# EasyEDA Pro project ProProject_FOCBalanceCar_2024-04-13.epro

# Schematic Schematic1
Create Date: 2024-03-26; Page Name: P1; Project Name: FOCBalanceCar; Schematic Name: Schematic1; Update Date: 2024-03-28; Company: 嘉立创EDA; Page Size: A3; Version: V1.0
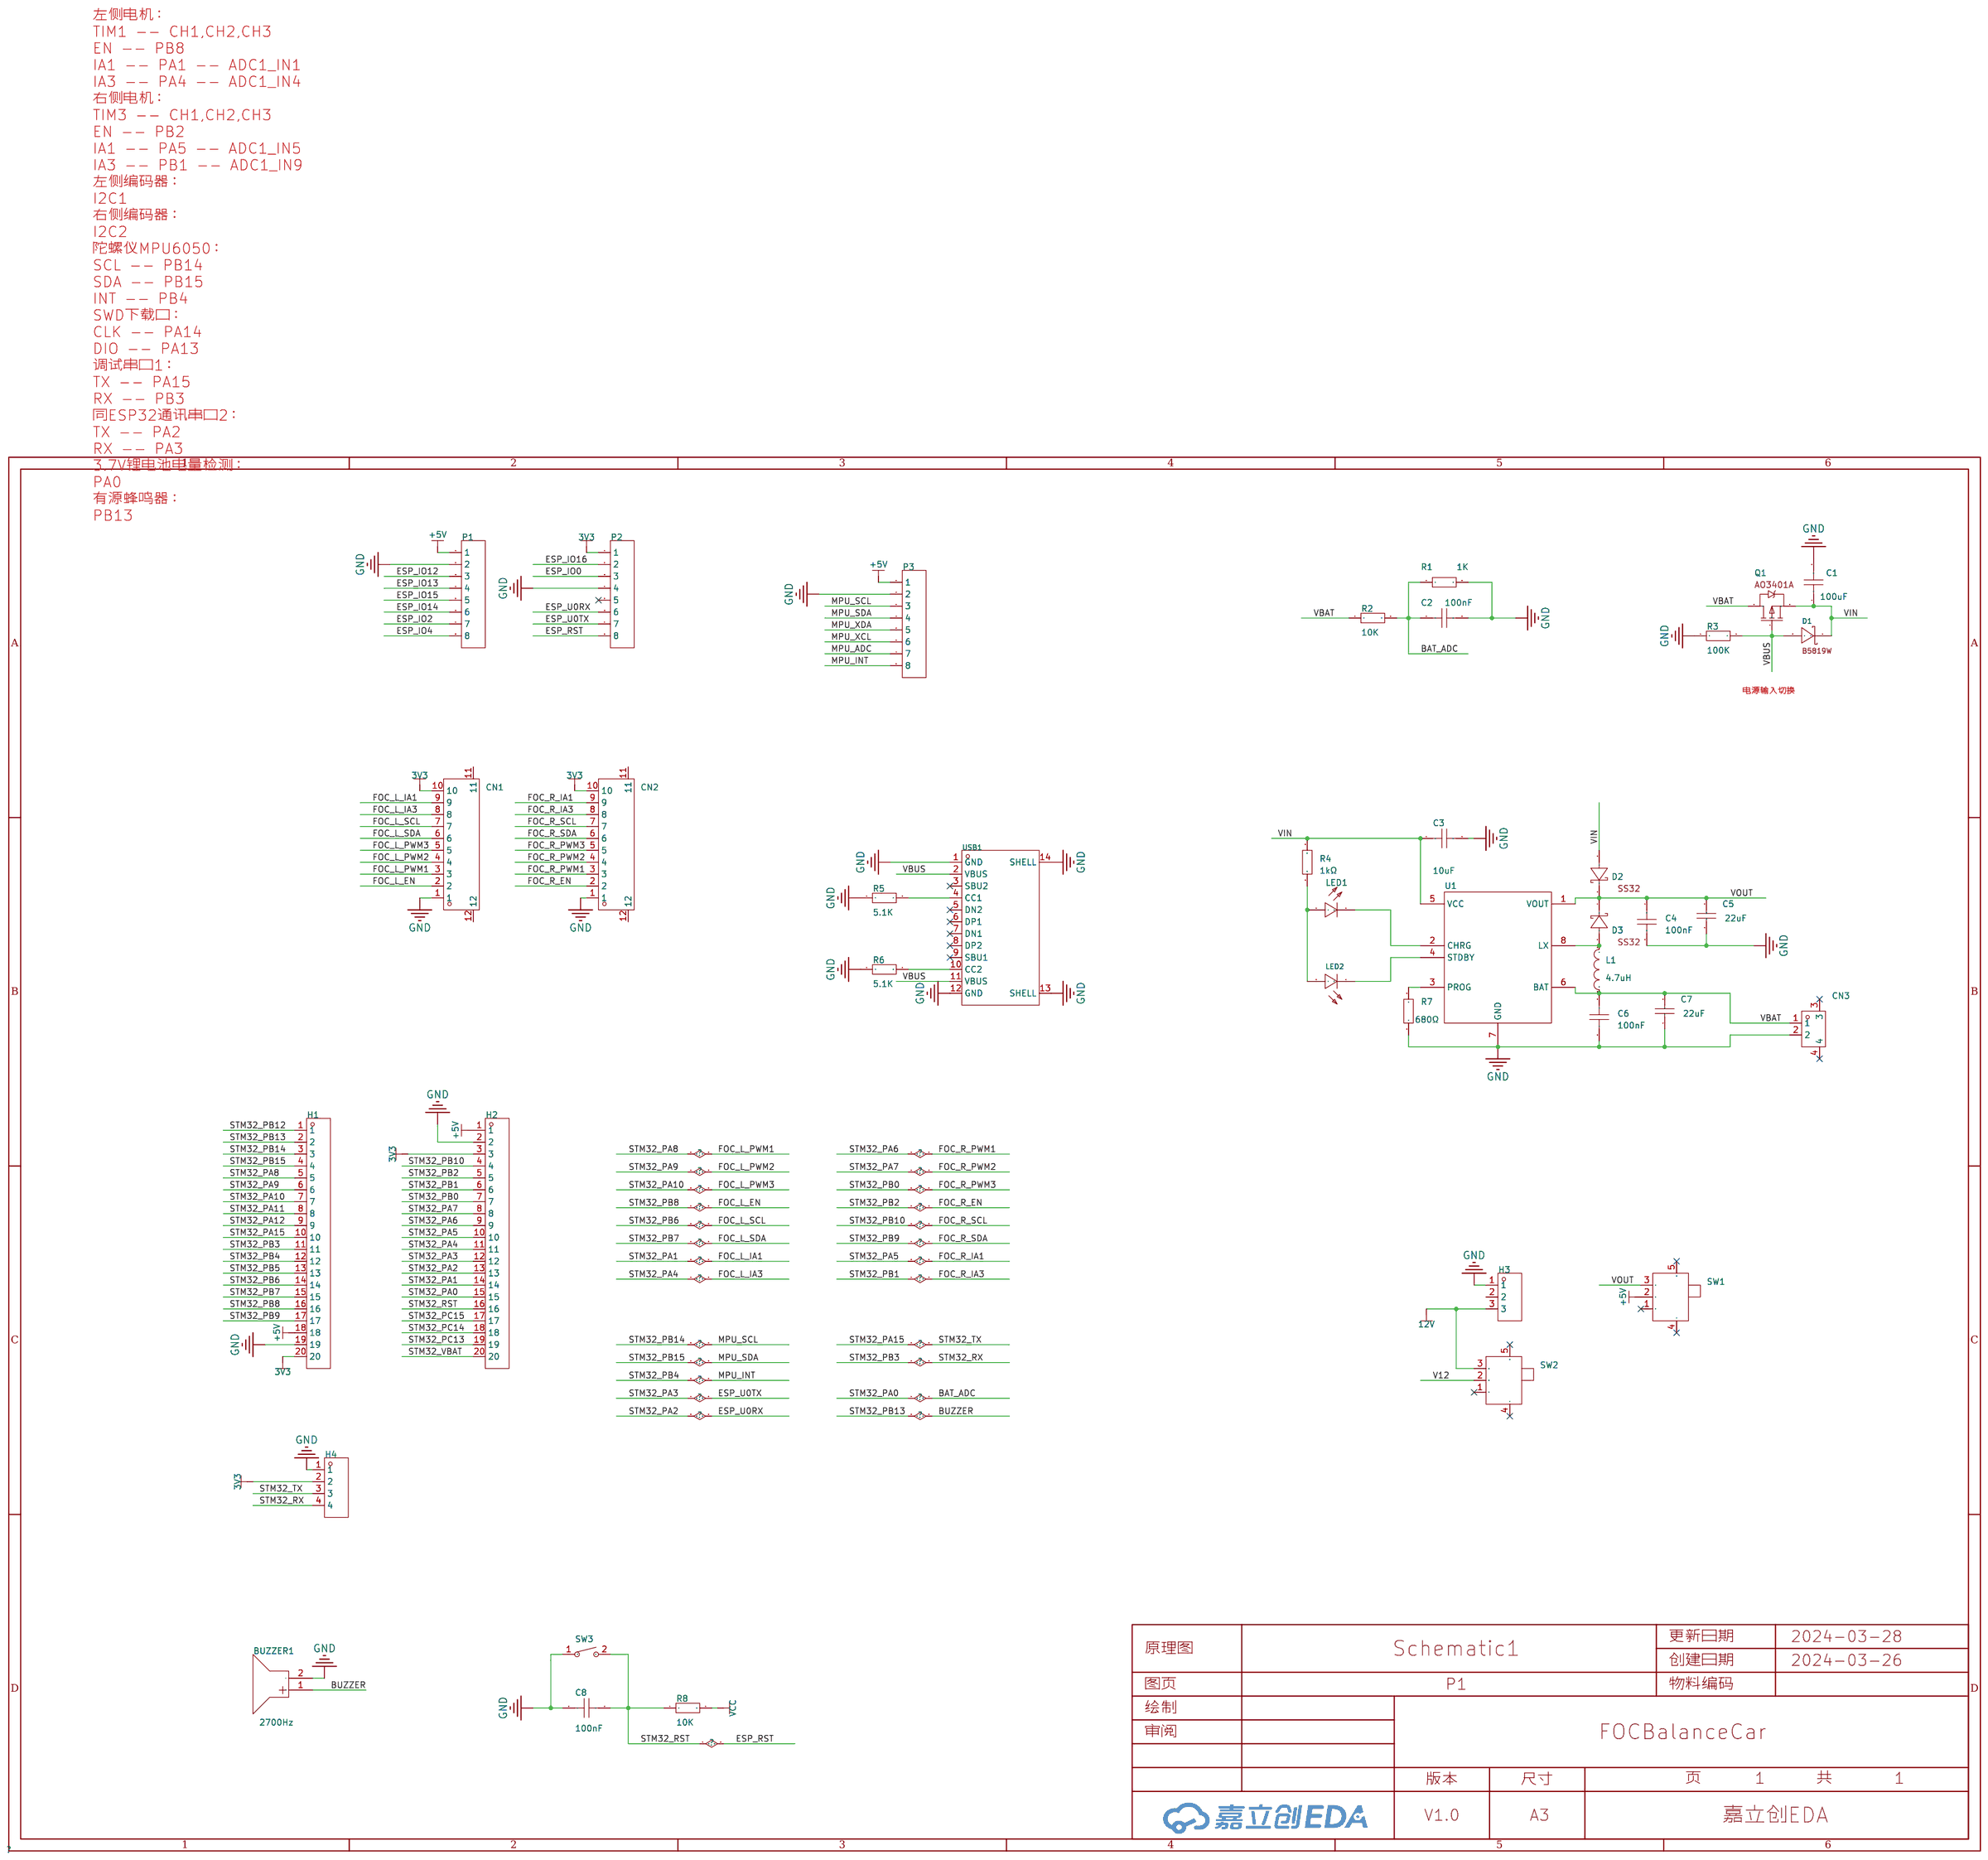
[diagram p0: schematic sheet]

## Parts
BUZZER1  2700Hz  [BUZ-TH_BD9.0-P5.00-D0.6-FD]
C1  100uF  [C0603]
C2  100nF  [C0603_1]
C3  10uF  [C0603]
C4  100nF  [C0603]
C5  22uF  [C1206]
C6  100nF  [C0603]
C7  22uF  [C1206]
C8  100nF  [C0603]
CN1  1.0-10P WT  [CONN-SMD_10P-P1.00_1.0-10P-WT]
CN2  1.0-10P WT  [CONN-SMD_10P-P1.00_1.0-10P-WT]
CN3  1.5-2P WT  [CONN-SMD_1.5-2P-WT]
D1  B5819W  [SOD-123_L2.8-W1.8-LS3.7-RD]
D2  -  [SMA_L4.2-W2.7-LS5.0-RD]
D3  -  [SMA_L4.2-W2.7-LS5.0-RD]
H1  22850120ANG1SYA01  [HDR-TH_20P-P2.54-V-F]
H2  22850120ANG1SYA01  [HDR-TH_20P-P2.54-V-F]
H3  PZ254R-11-03P  [HDR-TH_3P-P2.54-H-M-W10.4]
H4  PZ254V-11-04P  [HDR-TH_4P-P2.54-V-M]
L1  4.7uH  [IND-SMD_L4.0-W4.0]
LED1  19-217/R6C-AL1M2VY/3T  [LED0603-RD]
LED2  19-217/GHC-YR1S2/3T  [LED0603-RD]
P1  2.54-1*8P母环保  [HDR-TH_8P-P2.54-V-F-1]
P2  2.54-1*8P母环保  [HDR-TH_8P-P2.54-V-F-1]
P3  2.54-1*8P母环保  [HDR-TH_8P-P2.54-V-F-1]
Q1  AO3401A  [SOT-23-3_L2.9-W1.3-P1.90-LS2.4-BR]
R1  1K  [R0603_1]
R2  10K  [R0603]
R3  100K  [R0603]
R4  1kΩ  [R0603]
R5  5.1K  [R0603]
R6  5.1K  [R0603]
R7  680Ω  [R0805]
R8  10K  [R0603]
SW1  SS12D07VG5 087  [SW-TH_SS12D07VG4]
SW2  SS12D07VG5 087  [SW-TH_SS12D07VG4]
SW3  TS342A2P-WZ  [SW-SMD_L4.0-W2.9-LS5.0]
U1  -  [TP5410_SOP8]
USB1  TYPE-C 16PIN 2MD(073)  [USB-C-SMD_TYPE-C-6PIN-2MD-073]

## Library data of the parts
BUZZER1 = FMB09A03-3V: 驱动方式:有源(内含驱动线路);构造类型:电磁式;额定电压:3V;工作电压:2V~4.2V;频率:2700Hz;声压(SPL):80dB@3V,10cm;直径(φD):9mm;高度:5.7mm;; LCSC Part Name: 电磁式3V 2700HZ; Supplier Part: C417385; Manufacturer: FUET(福声科技); Supplier Footprint: 插件; JLCPCB Part Class: 扩展库; Datasheet: https://atta.szlcsc.com/upload/public/pdf/source/20200513/C417385_7DAABD1634B445C5EA862EA31FBF59FC.pdf; Supplier: LCSC; Oscillator Circuit: 有源(内含驱动线路); Technology Type: 电磁式; Rated Voltage: 3V; Operating Voltage: 2V~4.2V; Sound Pressure Level (SPL): 80dB@3V,10cm; Diameter (φD): 9mm; Height: 5.7mm
C1 C3 C8 = CAP_0603: Supplier Footprint: 0603
C2 = CC0603KRX7R9BB104_1: 容值:100nF;精度:±10%;额定电压:50V;温度系数:X7R;; LCSC Part Name: 100nF ±10% 50V; Supplier Part: C14663; Manufacturer: YAGEO(国巨); Manufacturer Part: CC0603KRX7R9BB104; Supplier Footprint: 0603; JLCPCB Part Class: Basic Part; Datasheet: https://atta.szlcsc.com/upload/public/pdf/source/20170116/1484561234239.pdf; Supplier: LCSC; Tolerance: ±10%; Voltage Rated: 50V; Temperature Coefficient: X7R
C4 C6 = CL10B104KB8NNNC: 容值:100nF;精度:±10%;额定电压:50V;温度系数:X7R;; LCSC Part Name: 100nF ±10% 50V; Supplier Part: C1591; Manufacturer: SAMSUNG(三星); Supplier Footprint: 0603; JLCPCB Part Class: Extended Part; Datasheet: https://atta.szlcsc.com/upload/public/pdf/source/20160103/1457707680512.pdf; Supplier: LCSC; Tolerance: ±10%; Voltage Rated: 50V; Temperature Coefficient: X7R
C5 C7 = CL31A226KAHNNNE: 容值:22uF;精度:±10%;额定电压:25V;温度系数:X5R;; LCSC Part Name: 22uF ±10% 25V; Supplier Part: C12891; Manufacturer: SAMSUNG(三星); Supplier Footprint: 1206; JLCPCB Part Class: Basic Part; Datasheet: https://atta.szlcsc.com/upload/public/pdf/source/20160103/1457707667836.pdf; Supplier: LCSC; Tolerance: ±10%; Voltage Rated: 25V; Temperature Coefficient: X5R
CN1 CN2 = 1.0-10P WT: 插针结构:1x10P;间距:1mm;安装方式:卧贴;参考系列:SH;总PIN数:10P;排数:1;每排PIN数:10;额定电流:1A;工作温度范围:-25℃~+85℃;; LCSC Part Name: 间距:1mm 1x10P 卧贴; Supplier Part: C5340780; Manufacturer: SHOU HAN(首韩); Supplier Footprint: SMD,P=1mm,卧贴; JLCPCB Part Class: 扩展库; Datasheet: https://atta.szlcsc.com/upload/public/pdf/source/20221228/5D518FEC817C7477F643AF327F50CF0F.pdf; Supplier: LCSC; Pins Structure: 1x10P; Pitch: 1mm; Mounting Style: 卧贴; Reference Series: SH; Number of Pins: 10P; Number of Rows: 1; Number of PINs Per Row: 10; Current Rating (Max): 1A; Operating Temperature Range: -25℃~+85℃
CN3 = 1.5-2P WT: 插针结构:1x2P;间距:1.5mm;公母:公;安装方式:卧贴;行距:-;排数:1;每排PIN数:2;参考系列:ZH;额定电流:1A;工作温度范围:-25℃~+85℃;; LCSC Part Name: 1x2P 间距:1.5mm 卧贴 系列:ZH; Supplier Part: C2681533; Manufacturer: SHOU HAN(首韩); Supplier Footprint: SMD,P=1.5mm; JLCPCB Part Class: 扩展库; Datasheet: https://atta.szlcsc.com/upload/public/pdf/source/20210107/C2681535_97741691CC21DAF8D9FC266F7E994B99.pdf; Supplier: LCSC; Pins Structure: 1x2P; Pitch: 1.5mm; Gender: 公; Mounting Style: 卧贴; Number of Rows: 1; Number of PINs Per Row: 2; Reference Series: ZH; Current Rating (Max): 1A; Operating Temperature Range: -25℃~+85℃
D1 = B5819W_C64885: 直流反向耐压(Vr):40V;平均整流电流(Io):1A;正向压降(Vf):600mV@1A;; LCSC Part Name: 电压:40V 电流:1A SL; Supplier Part: C64885; Manufacturer: MDD; Supplier Footprint: SOD-123; JLCPCB Part Class: Extended Part; Datasheet: https://atta.szlcsc.com/upload/public/pdf/source/20230823/08094EB15E96CCD3558B35DDD25E45C2.pdf; Supplier: LCSC; Reverse Voltage (Vr): 40V; Average Rectified Current (Io): 1A; Forward Voltage (Vf@If): 600mV@1A
D2 D3 = SS32: 二极管配置:-;直流反向耐压(Vr):20V;平均整流电流(Io):3A;正向压降(Vf):550mV@3A;反向电流(Ir):500A@20V;; LCSC Part Name: 20V 3A 550mV@3A; Supplier Part: C2891717; Manufacturer: KUU; Supplier Footprint: SMA(DO-214AC); JLCPCB Part Class: Extended Part; Datasheet: https://atta.szlcsc.com/upload/public/pdf/source/20210901/43FECDC7C0D2D5B6002302D3612B6747.pdf; Supplier: LCSC; Reverse Voltage (Vr): 20V; Average Rectified Current (Io): 3A; Forward Voltage (Vf@If): 550mV@3A; Reverse Leakage Current (Ir): 500A@20V
H1 H2 = 22850120ANG1SYA01: 插孔结构:1x20P;间距:2.54mm;行距:-;安装类型:直插;排数:单排;总孔位数:20P;塑高:-;触头材质:黄铜;触头镀层:-;; LCSC Part Name: 间距:2.54mm 1x20P 直插; Supplier Part: C429947; Manufacturer: JILN(锦凌); Supplier Footprint: 插件,P=2.54mm; JLCPCB Part Class: 扩展库; Datasheet: https://atta.szlcsc.com/upload/public/pdf/source/20190920/C429966_F6288D72CB1EF194DAF75E8AC5D57877.pdf; Supplier: LCSC; Holes Structure: 1x20P; Pitch: 2.54mm; Mounting Type: 直插; Number of Rows: 单排; Number of Holes: 20P; Contact Material: 黄铜
H3 = PZ254R-11-03P: 插针结构:1x3P;间距:2.54mm;行距:-;圆针/方针:方针;安装类型:弯插;排数:单排;总PIN位数:3P;额定电流:-;额定电压:-;配合针长度:6mm;塑高:2.5mm;触头材质:黄铜;触头镀层:-;工作温度范围:-40℃~+105℃;颜色:黑色;; LCSC Part Name: 间距:2.54mm 1x3P 弯插 方针; Supplier Part: C492411; Manufacturer: XFCN(兴飞); Supplier Footprint: 弯插,P=2.54mm; JLCPCB Part Class: 扩展库; Datasheet: https://atta.szlcsc.com/upload/public/pdf/source/20200309/C492411_5256E8AAA7569F6D33B6ADBFAE4F2888.pdf; Supplier: LCSC; Pin Structure: 1x3P; Pitch: 2.54mm; Circluar Pins/Square Pins: 方针; Mounting Type: 弯插; Number of Rows: 单排; Number of Pins: 3P; Length of Mating Pin: 6mm; Insulation Height: 2.5mm; Contact Material: 黄铜; Operating Temperature Range: -40℃~+105℃; Color: 黑色
H4 = PZ254V-11-04P: 插针结构:1x4P;间距:2.54mm;行距:-;圆针/方针:方针;安装类型:直插;排数:单排;总PIN位数:4P;额定电流:3A;额定电压:250V;配合针长度:6mm;塑高:2.5mm;端接针长度:3mm;触头材质:-;工作温度范围:-40℃~+105℃;颜色:黑色;; LCSC Part Name: 间距:2.54mm 1x4P 直插 方针; Supplier Part: C2691448; Manufacturer: XFCN(兴飞); Supplier Footprint: 插件,P=2.54mm; JLCPCB Part Class: 扩展库; Datasheet: https://atta.szlcsc.com/upload/public/pdf/source/20200309/C492403_F9F19131791D08044AD4F84F8E751A34.pdf; Supplier: LCSC; Pin Structure: 1x4P; Pitch: 2.54mm; Circluar Pins/Square Pins: 方针; Mounting Type: 直插; Number of Rows: 单排; Number of Pins: 4P; Current Rating (Max): 3A; Voltage Rating (Max): 250V; Length of Mating Pin: 6mm; Insulation Height: 2.5mm; Length of End Connection Pin: 3mm; Operating Temperature Range: -40℃~+105℃; Color: 黑色
L1 = SWPA4030S4R7MT: 直流电阻(DCR):78mΩ;精度:±20%;电感值:4.7uH;额定电流:2A;; LCSC Part Name: 4.7uH ±20%; Supplier Part: C57269; Manufacturer: Sunlord(顺络); Supplier Footprint: SMD; JLCPCB Part Class: Extended Part; Datasheet: https://atta.szlcsc.com/upload/public/pdf/source/20161024/1477287957557.pdf; Supplier: LCSC; DC Resistance (DCR): 78mΩ; Tolerance: ±20%; Height: 3mm; Width: 4mm; Rated Current: 2A; Length: 4mm
LED1 = 19-217/R6C-AL1M2VY/3T: 发光颜色:红灯;二极管配置:-;主波长:617.5nm;色温:-;功率:60mW;安装方式:-;; LCSC Part Name: 红灯; Supplier Part: C72044; Manufacturer: EVERLIGHT(亿光); Supplier Footprint: 0603; JLCPCB Part Class: 扩展库; Datasheet: https://atta.szlcsc.com/upload/public/pdf/source/20160507/1462613613821.pdf; Supplier: LCSC; Emitted Color: 红灯; Lens Color: 无色透明; Dominant Wavelength: 617.5nm; Peak Wavelength: 632nm; Forward Current: 5mA; Power Dissipation: 60mW; Viewing Angle: 120°; Operating Temperature: -40℃~+85℃
LED2 = 19-217/GHC-YR1S2/3T: 发光颜色:翠绿;二极管配置:-;主波长:520nm~535nm;色温:-;功率:110mW;安装方式:-;; LCSC Part Name: 翠绿; Supplier Part: C72043; Manufacturer: EVERLIGHT(亿光); Supplier Footprint: 0603; JLCPCB Part Class: 基础库; Datasheet: https://atta.szlcsc.com/upload/public/pdf/source/20160507/1462613613780.pdf; Supplier: LCSC; Emitted Color: 翠绿; Lens Color: 无色透明; Dominant Wavelength: 520nm~535nm; Peak Wavelength: 518nm; Forward Current: 20mA; Forward Voltage (VF): 3.3V; Luminous Intensity: 199mcd; Power Dissipation: 110mW; Viewing Angle: 120°; Operating Temperature: -40℃~+85℃
P1-P3 = 2.54-1*8P母环保: 插孔结构:1x8P;间距:2.54mm;行距:-;安装类型:直插;排数:单排;总孔位数:8P;塑高:-;触头材质:-;触头镀层:-;; LCSC Part Name: 间距:2.54mm 1x8P 直插; Supplier Part: C27438; Manufacturer: BOOMELE(博穆精密); Supplier Footprint: 插件,P=2.54mm; JLCPCB Part Class: 扩展库; Datasheet: https://atta.szlcsc.com/upload/public/pdf/source/20231221/1CA800C6799ED97958773716FAA1BFFE.pdf; Supplier: LCSC; Holes Structure: 1x8P; Pitch: 2.54mm; Mounting Type: 直插; Number of Rows: 单排; Number of Holes: 8P
Q1 = AO3401A_C306862: 类型:P沟道;漏源电压(Vdss):30V;连续漏极电流(Id):4.2A;功率(Pd):1.4W;导通电阻(RDS(on)@Vgs,Id):50mΩ@10V,4.1A;阈值电压(Vgs(th)@Id):2V@250uA;; LCSC Part Name: P沟道 30V 4.2A; Supplier Part: C306862; Manufacturer: BORN(伯恩半导体); Supplier Footprint: SOT-23; JLCPCB Part Class: 扩展库; Datasheet: https://atta.szlcsc.com/upload/public/pdf/source/20190514/C306862_F7EF2FFF49BA48EA0D342955B5285B33.pdf; Supplier: LCSC; Type: P沟道; Drain Source Voltage (Vdss): 30V; Continuous Drain Current (Id): 4.2A; Power Dissipation (Pd): 1.4W; Drain Source On Resistance (RDS(on)@Vgs,Id): 50mΩ@10V,4.1A; Gate Threshold Voltage (Vgs(th)@Id): 2V@250uA
R1 = TR0603B10K0P0525Z_1: 电阻类型:薄膜电阻;阻值:10k;精度:±0.1%;功率:100mW;温度系数:±25ppm/;最大工作电压:75V;工作温度范围:-55~+155;; LCSC Part Name: 10k ±0.1% 100mW; Supplier Part: C188363; Manufacturer: EVER OHMS(天二科技); Manufacturer Part: TR0603B10K0P0525Z; Supplier Footprint: 0603; JLCPCB Part Class: Extended Part; Datasheet: https://atta.szlcsc.com/upload/public/pdf/source/20190415/C188363_433BF05B6FB8F7A0F5F35A3E4390C55A.pdf; Supplier: LCSC; Type: 薄膜电阻; Tolerance: ±0.1%; Power(Watts): 100mW; Temperature Coefficient: ±25ppm/; Overload Voltage (Max): 75V; Operating Temperature Range: -55~+155
R2 R3 R5 R6 R8 = Res_0603: Supplier Footprint: 0603
R4 = 0603WAF1001T5E: 电阻类型:厚膜电阻;阻值:1kΩ;精度:±1%;功率:1/10W;温度系数:±100ppm/;最大工作电压:75V;工作温度范围:-55~+155;; LCSC Part Name: 1kΩ ±1% 1/10W; Supplier Part: C21190; Manufacturer: UNI-ROYAL(厚声); Supplier Footprint: 0603; JLCPCB Part Class: Basic Part; Datasheet: https://atta.szlcsc.com/upload/public/pdf/source/20200306/C422600_1E6D84923E4A46A82E41ADD87F860B5C.pdf; Supplier: LCSC; Type: 厚膜电阻; Tolerance: ±1%; Power(Watts): 1/10W; Temperature Coefficient: ±100ppm/; Overload Voltage (Max): 75V; Operating Temperature Range: -55~+155
R7 = 0805W8F6800T5E: 阻值:680Ω;精度:±1%;温度系数:±100ppm/;功率:1/8W;最大工作电压:150V;工作温度范围:-55~+155;; LCSC Part Name: 680Ω ±1%; Supplier Part: C17798; Manufacturer: UNI-ROYAL(厚声); Supplier Footprint: 0805; JLCPCB Part Class: Basic Part; Datasheet: https://atta.szlcsc.com/upload/public/pdf/source/20170920/C17798_1505887250744980150.pdf; Supplier: LCSC; Tolerance: ±1%; Temperature Coefficient: ±100ppm/; Power(Watts): 1/8W; Overload Voltage (Max): 150V; Operating Temperature Range: -55~+155
SW1 SW2 = SS12D07VG5 087: 电路结构:单刀双掷;安装方式:立插;开关颜色:-;额定电流(DC):300mA;额定电压(DC):50V;额定电流(AC):-;额定电压(AC):-;机械寿命:5千次;; Supplier Part: C2939727; Manufacturer: SHOU HAN(首韩); Supplier Footprint: 插件; JLCPCB Part Class: 扩展库; Datasheet: https://atta.szlcsc.com/upload/public/pdf/source/20220106/E749AC83D6CEBCB0CB236FADE7A5BC5C.pdf; Supplier: LCSC; Circuit: 单刀双掷; Pin Style: PC引脚; Switch Length: 8.7mm; Switch Width: 4.4mm; Switch Height: 4.7mm; Mounting Style: 立插; Current Rating (DC): 300mA; Voltage Rating (DC): 50V; Mechanical Life: 5千次; Operating Temperature: -10℃~+50℃
SW3 = TS342A2P-WZ: 电路结构:单刀单掷;按钮形状:圆形按钮;安装方式:立贴;开关长度:3.95mm;开关宽度:2.9mm;开关高度:2mm;带支架:不带;触点电流:50mA;额定电压(DC):12V;绝缘电阻:100MΩ;机械寿命:3万次;; LCSC Part Name: 3.95*2.9*2mm 立贴 轻触开关; Supplier Part: C557591; Manufacturer: SHOU HAN(首韩); Supplier Footprint: SMD; JLCPCB Part Class: 扩展库; Datasheet: https://atta.szlcsc.com/upload/public/pdf/source/20200519/C557591_B3A5A21584733303F06306F18577DA8B.pdf; Supplier: LCSC; Circuit: 单刀单掷; Actuator Style: 圆形按钮; Mounting Style: 立贴; Switch Length: 3.95mm; Switch Width: 2.9mm; Switch Height: 2mm; Strike Gundam: 不带; Contact Current: 50mA; Voltage Rating (DC): 12V; Insulation Resistance: 100MΩ; Actuator/Cap Color: 黑色; Pin Style: SMD接片; Mechanical Life: 3万次; Operating Temperature: -25℃~+70℃
U1 = TP5410SOP8
USB1 = TYPE-C 16PIN 2MD(073): 连接器类型:Type-C;标准:-;公母:母座;触点数量:16;端口数量:1;安装方式:卧贴;额定电流 - 电源:5A;工作温度范围:-25℃~+85℃;; LCSC Part Name: TYPE-C母座 16P 4脚插件带定位柱 不锈钢外壳 2次模顶; Supplier Part: C2765186; Manufacturer: SHOU HAN(首韩); Supplier Footprint: SMD; JLCPCB Part Class: 扩展库; Supplier: LCSC; Connector Type: Type-C; Gender: 母座; Number of Contacts: 16; Number of Ports: 1; Mounting Style: 卧贴; Current Rating - Power (Max): 5A; Operating Temperature Range: -25℃~+85℃

## Nets
3V3: CN1.10 CN2.10 H1.20 H2.3 H4.2 P2.1
12V: H3.3 SW2.3
+5V: H1.18 H2.1 P1.1 P3.1 SW1.2
GND: BUZZER1.2(-) C1.2 C2.2 C3.2 C4.2 C5.1 C6.2 C7.1 C8.1 CN1.1 CN2.1 CN3.2 H1.19 H2.2 H3.1 H4.1 P1.2 P2.4 P3.2 R1.2 R3.1 R5.1 R6.1 R7.1 SW3.1 U1.7(GND) USB1.1(GND) USB1.12(GND) USB1.13(SHELL) USB1.14(SHELL)
V12: SW2.2
VBAT: C6.1 C7.2 CN3.1 L1.1 Q1.3(D) R2.1 U1.6(BAT)
VBUS: D1.2(A) Q1.1(G) R3.2 USB1.2(VBUS) USB1.11(VBUS)
VCC: R8.2
VIN: C1.1 C3.1 D1.1(K) D2.2(A) Q1.2(S) R4.2 U1.5(VCC)
BAT_ADC: C2.1 H2.15 R1.1 R2.2
BUZZER: BUZZER1.1(+) H1.2
ESP_IO0: P2.3
ESP_IO2: P1.7
ESP_IO4: P1.8
ESP_IO12: P1.3
ESP_IO13: P1.4
ESP_IO14: P1.6
ESP_IO15: P1.5
ESP_IO16: P2.2
ESP_RST: C8.2 H2.16 P2.8 R8.1 SW3.2
ESP_U0RX: H2.13 P2.6
ESP_U0TX: H2.12 P2.7
FOC_L_EN: CN1.2 H1.16
FOC_L_IA1: CN1.9 H2.14
FOC_L_IA3: CN1.8 H2.11
FOC_L_PWM1: CN1.3 H1.5
FOC_L_PWM2: CN1.4 H1.6
FOC_L_PWM3: CN1.5 H1.7
FOC_L_SCL: CN1.7 H1.14
FOC_L_SDA: CN1.6 H1.15
FOC_R_EN: CN2.2 H2.5
FOC_R_IA1: CN2.9 H2.10
FOC_R_IA3: CN2.8 H2.6
FOC_R_PWM1: CN2.3 H2.9
FOC_R_PWM2: CN2.4 H2.8
FOC_R_PWM3: CN2.5 H2.7
FOC_R_SCL: CN2.7 H2.4
FOC_R_SDA: CN2.6 H1.17
MPU_ADC: P3.7
MPU_INT: H1.12 P3.8
MPU_SCL: H1.3 P3.3
MPU_SDA: H1.4 P3.4
MPU_XCL: P3.6
MPU_XDA: P3.5
STM32_PA11: H1.8
STM32_PA12: H1.9
STM32_PA15: H1.10 H4.3
STM32_PB3: H1.11 H4.4
STM32_PB5: H1.13
STM32_PB12: H1.1
STM32_PC13: H2.19
STM32_PC14: H2.18
STM32_PC15: H2.17
STM32_VBAT: H2.20
VOUT: C4.1 C5.2 D2.1(K) D3.1(K) SW1.3 U1.1(VOUT)
$1N4508: R5.2 USB1.4(CC1)
$1N4509: R6.2 USB1.10(CC2)
$1N8495: LED1.1(C) U1.2(CHRG)
$1N8496: LED2.1(C) U1.4(STDBY)
$1N8497: LED1.2(A) LED2.2(A) R4.1
$1N8502: R7.2 U1.3(PROG)
$1N8503: D3.2(A) L1.2 U1.8(LX)

Not connected (* = marked no-connect by the designer): CN1 11 12; CN2 11 12; CN3 3* 4*; H3 2; P2 5*; SW1 1* 4* 5*; SW2 1* 4* 5*; USB1 3(SBU2)* 5(DN2)* 6(DP1)* 7(DN1)* 8(DP2)* 9(SBU1)*

## Notes on the sheet
- 左侧电机：
  TIM1 -- CH1,CH2,CH3
  EN -- PB8
  IA1 -- PA1 -- ADC1_IN1
  IA3 -- PA4 -- ADC1_IN4
  右侧电机：
  TIM3 -- CH1,CH2,CH3
  EN -- PB2
  IA1 -- PA5 -- ADC1_IN5
  IA3 -- PB1 -- ADC1_IN9
  左侧编码器：
  I2C1
  右侧编码器：
  I2C2
  陀螺仪MPU6050：
  SCL -- PB14
  SDA -- PB15
  INT -- PB4
  SWD下载口：
  CLK -- PA14
  DIO -- PA13
  调试串口1：
  TX -- PA15
  RX -- PB3
  同ESP32通讯串口2：
  TX -- PA2
  RX -- PA3
  3.7V锂电池电量检测：
  PA0
  有源蜂鸣器：
  PB13
- 电源输入切换

# Schematic Schematic2
Create Date: 2024-02-16; Page Name: P1; Project Name: rosBot; Schematic Name: Schematic1; Update Date: 2024-02-21; Company: 嘉立创EDA; Page Size: A3; Version: V1.0
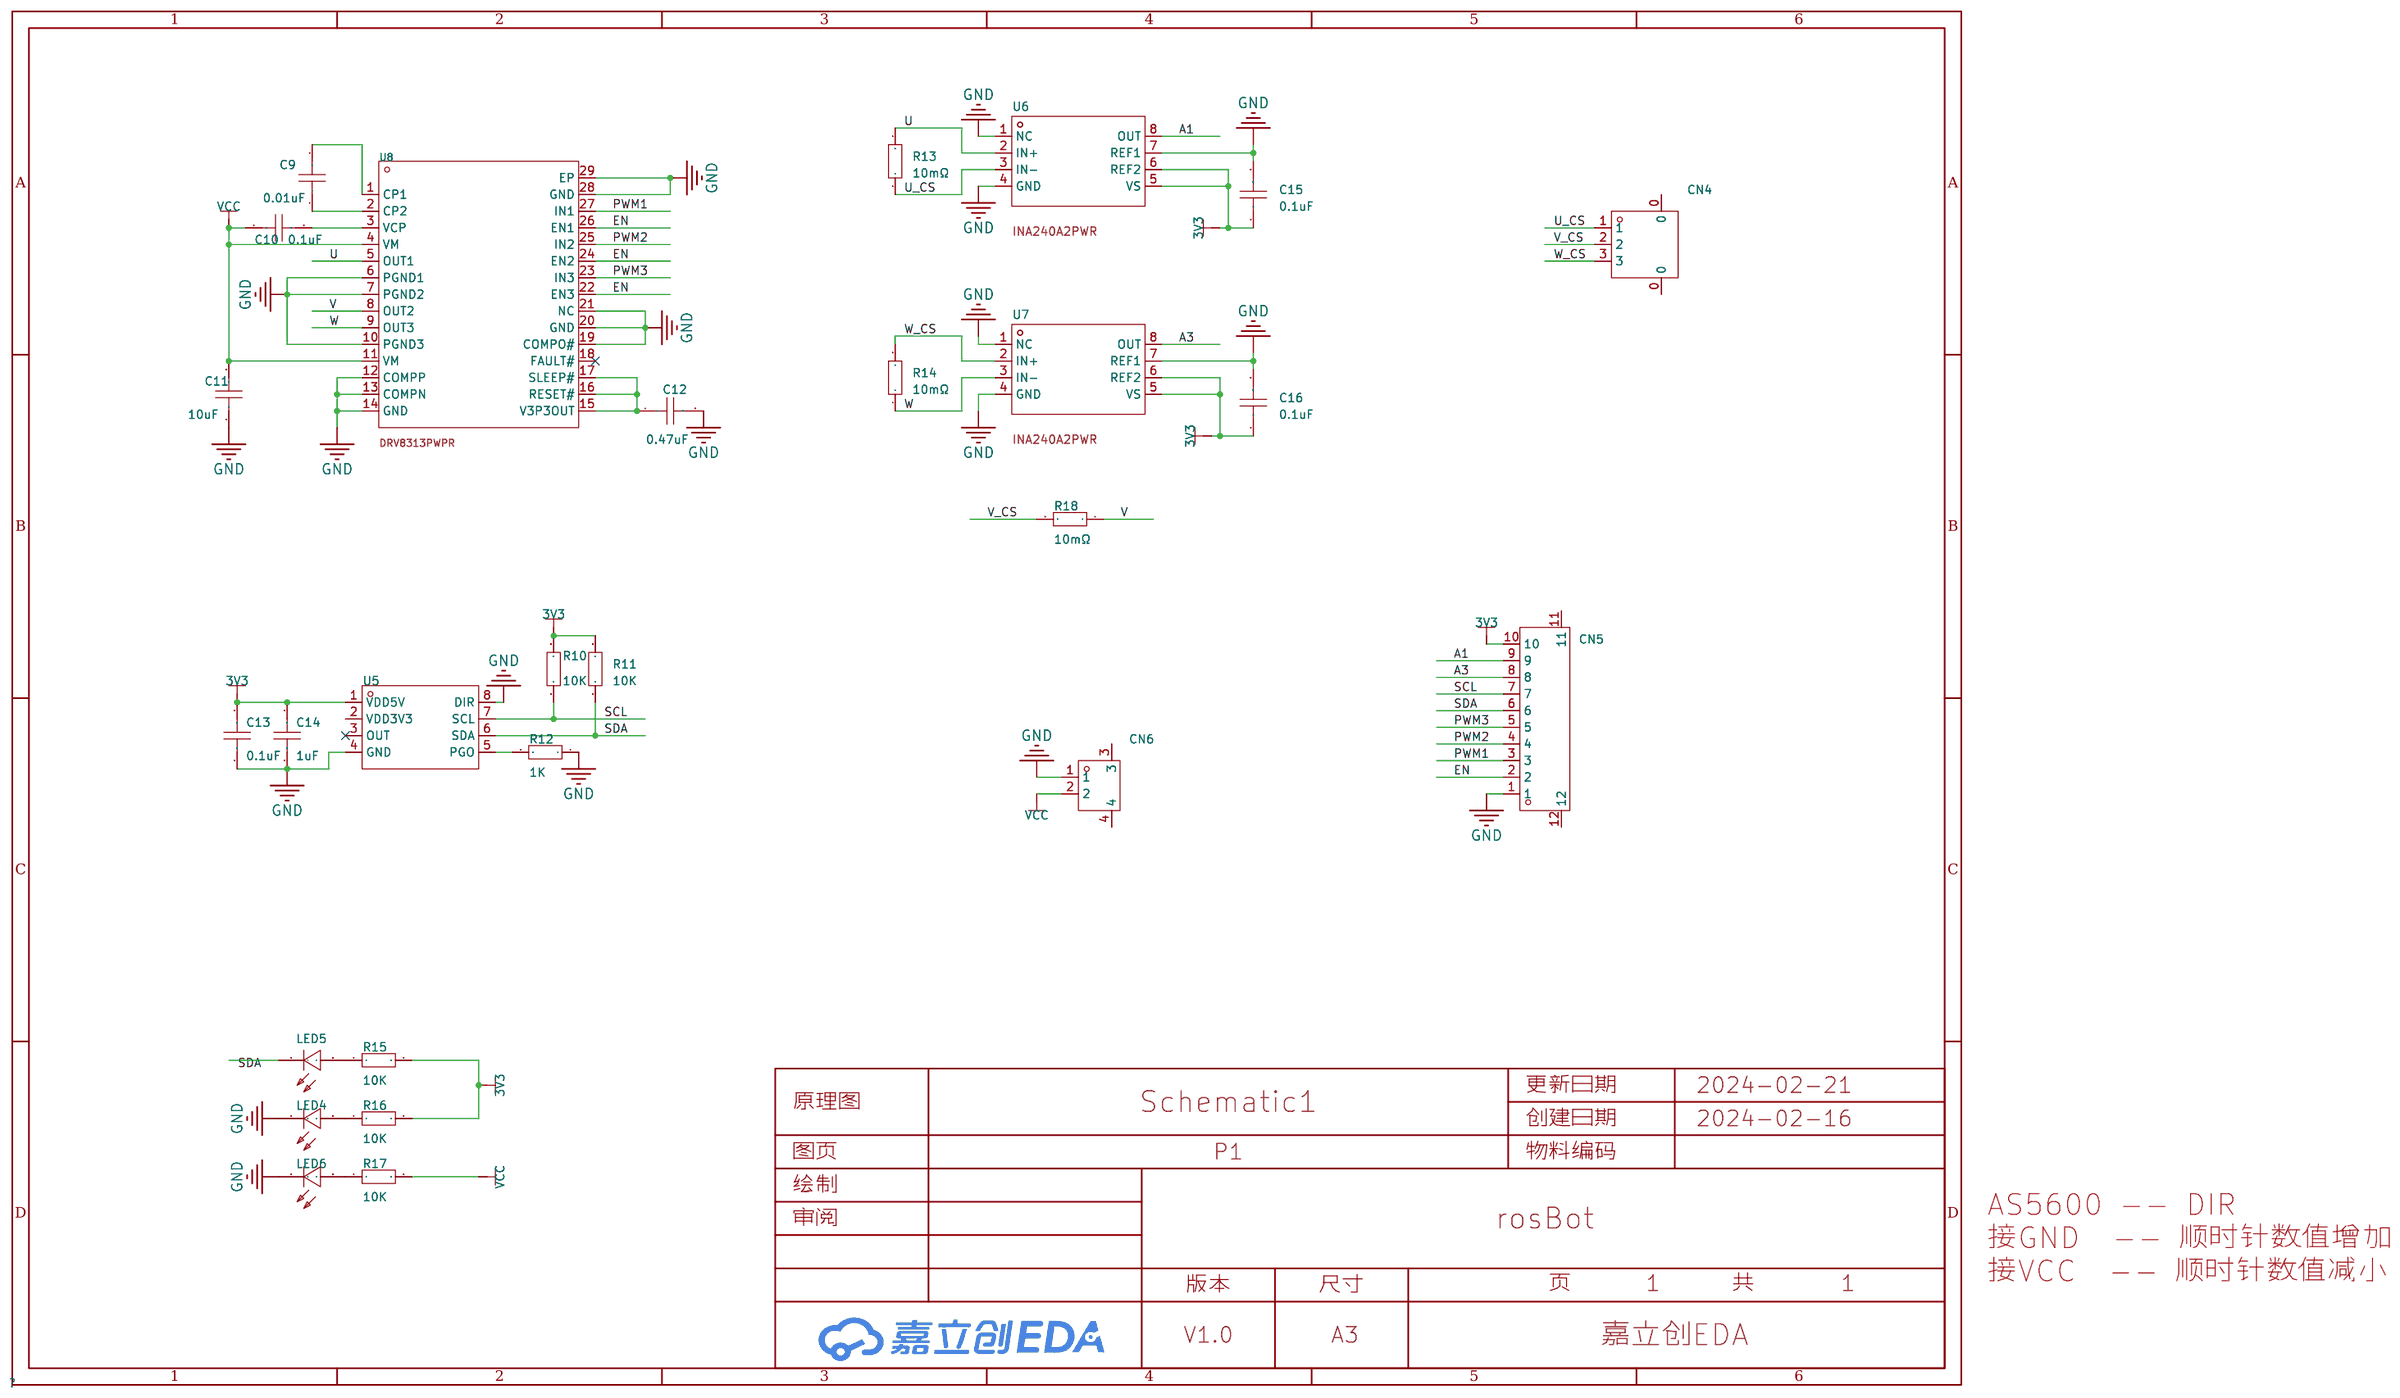
[diagram p1: schematic sheet]

## Parts
C9  0.01uF  [C0603]
C10  0.1uF  [C0603]
C11  10uF  [C0603]
C12  0.47uF  [C0603]
C13  0.1uF  [C0603]
C14  1uF  [C0603]
C15  0.1uF  [C0603]
C16  0.1uF  [C0603]
CN4  1.0T-3P卧贴  [CONN-SMD_1.0T-3P]
CN5  1.0-10P WT  [CONN-SMD_10P-P1.00_1.0-10P-WT]
CN6  HCZZ0323-2  [CONN-SMD_2P-P1.50_HCZZ0323-2]
LED4  NCD0603G1  [LED0603-RD]
LED5  NCD0603B1  [LED0603-RD]
LED6  NCD0603R1  [LED0603-RD_RED]
R10  10K  [R0603]
R11  10K  [R0603]
R12  1K  [R0603]
R13  10mΩ  [R2512]
R14  10mΩ  [R2512]
R15  10K  [R0603]
R16  10K  [R0603]
R17  10K  [R0603]
R18  10mΩ  [R2512]
U5  AS5600-ASOT  [SOIC-8_L5.0-W4.0-P1.27-LS6.0-BL]
U6  INA240A2PWR  [TSSOP-8_L4.4-W3.0-P0.65-LS6.4-BL]
U7  INA240A2PWR  [TSSOP-8_L4.4-W3.0-P0.65-LS6.4-BL]
U8  DRV8313PWPR  [HTSSOP-28_L9.8-W4.5-P0.65-LS6.6-BL-EP]

## Library data of the parts
C9-C16 = CAP_0603: Supplier Footprint: 0603
CN4 = 1.0T-3P卧贴: 插针结构:1x3P;间距:1mm;安装方式:-;参考系列:SH;总PIN数:3P;排数:1;每排PIN数:3;行距:-;触头材质:磷铜;; LCSC Part Name: 系列:SH 间距:1mm 1x3P; Supplier Part: C145955; Manufacturer: BOOMELE(博穆精密); Supplier Footprint: SMD,P=1mm; JLCPCB Part Class: 扩展库; Datasheet: https://atta.szlcsc.com/upload/public/pdf/source/20171115/C145958_15107293423141120443.pdf; Supplier: LCSC; Pins Structure: 1x3P; Pitch: 1mm; Reference Series: SH; Number of Pins: 3P; Number of Rows: 1; Number of PINs Per Row: 3; Contact Material: 磷铜
CN5 = 1.0-10P WT: 插针结构:1x10P;间距:1mm;安装方式:卧贴;参考系列:SH;总PIN数:10P;排数:1;每排PIN数:10;额定电流:1A;工作温度范围:-25℃~+85℃;; LCSC Part Name: 间距:1mm 1x10P 卧贴; Supplier Part: C5340780; Manufacturer: SHOU HAN(首韩); Supplier Footprint: SMD,P=1mm,卧贴; JLCPCB Part Class: 扩展库; Datasheet: https://atta.szlcsc.com/upload/public/pdf/source/20221228/5D518FEC817C7477F643AF327F50CF0F.pdf; Supplier: LCSC; Pins Structure: 1x10P; Pitch: 1mm; Mounting Style: 卧贴; Reference Series: SH; Number of Pins: 10P; Number of Rows: 1; Number of PINs Per Row: 10; Current Rating (Max): 1A; Operating Temperature Range: -25℃~+85℃
CN6 = HCZZ0323-2: 插针结构:1x2P;间距:1.5mm;安装方式:卧贴;参考系列:ZH;总PIN数:2P;排数:1;每排PIN数:2;额定电流:1A;触头材质:黄铜;触头镀层:镀锡;工作温度范围:-25℃~+85℃;; LCSC Part Name: 1x2P 间距:1.5mm 卧贴 系列:ZH 米色; Supplier Part: C7433558; Manufacturer: HC(虹成电子); Supplier Footprint: SMD,P=1.5mm,卧贴; JLCPCB Part Class: 扩展库; Datasheet: https://atta.szlcsc.com/upload/public/pdf/source/20230707/7C41A9603B62BBD8603EB93A6586D0BE.pdf; Supplier: LCSC; Pins Structure: 1x2P; Pitch: 1.5mm; Mounting Style: 卧贴; Reference Series: ZH; Number of Pins: 2P; Number of Rows: 1; Number of PINs Per Row: 2; Current Rating (Max): 1A; Contact Material: 黄铜; Contact Plating: 镀锡; Operating Temperature Range: -25℃~+85℃
LED4 = NCD0603G1: 发光颜色:翠绿色;正向电压(VF):2.6V~3.6V;功率:72mW;正向电流:10mA;主波长:515nm~530nm;透镜颜色:无色透明透镜;发光强度:330mcd~900mcd;发光角度:130°;工作温度:-30℃~+85℃;; Supplier Part: C84267; Manufacturer: 国星光电; Supplier Footprint: 0603; JLCPCB Part Class: 扩展库; Datasheet: https://atta.szlcsc.com/upload/public/pdf/source/20200820/C84267_04BA7703640BAC111D09F5EFB971FBF3.pdf; Supplier: LCSC; Emitted Color: 翠绿色; Forward Voltage (VF): 2.6V~3.6V; Power Dissipation: 72mW; Forward Current: 10mA; Dominant Wavelength: 515nm~530nm; Lens Color: 无色透明透镜; Luminous Intensity: 330mcd~900mcd; Viewing Angle: 130°; Operating Temperature: -30℃~+85℃
LED5 = NCD0603B1: 发光颜色:蓝色;正向电压(VF):2.6V~3.6V;功率:72mW;正向电流:10mA;主波长:463nm~475nm;透镜颜色:无色透明透镜;发光强度:80mcd~220mcd;发光角度:130°;工作温度:-30℃~+85℃;; Supplier Part: C84266; Manufacturer: 国星光电; Supplier Footprint: 0603; JLCPCB Part Class: 扩展库; Datasheet: https://atta.szlcsc.com/upload/public/pdf/source/20200820/C84266_6A3CDBEFA72C6CAD68EDA53474ADAE6C.pdf; Supplier: LCSC; Emitted Color: 蓝色; Forward Voltage (VF): 2.6V~3.6V; Power Dissipation: 72mW; Forward Current: 10mA; Dominant Wavelength: 463nm~475nm; Lens Color: 无色透明透镜; Luminous Intensity: 80mcd~220mcd; Viewing Angle: 130°; Operating Temperature: -30℃~+85℃
LED6 = NCD0603R1_C84263: 灯头类型:-;发光颜色:红色;正向电压(VF):1.6V~2.6V;功率:65mW;正向电流:20mA;主波长:615nm~630nm;二极管配置:独立二极管;透镜颜色:无色透明透镜;色温:-;发光强度:80mcd~220mcd;发光角度:130°;载带方式:-;工作温度:-30℃~+85℃;; Supplier Part: C84263; Manufacturer: 国星光电; Supplier Footprint: 0603; JLCPCB Part Class: 扩展库; Datasheet: https://atta.szlcsc.com/upload/public/pdf/source/20200820/C84263_DABC6A75E58F576973B407FDBA283D60.pdf; Supplier: LCSC; Emitted Color: 红色; Forward Voltage (VF): 1.6V~2.6V; Power Dissipation: 65mW; Forward Current: 20mA; Dominant Wavelength: 615nm~630nm; Diode Configuration: 独立二极管; Lens Color: 无色透明透镜; Luminous Intensity: 80mcd~220mcd; Viewing Angle: 130°; Operating Temperature: -30℃~+85℃
R10-R12 R15-R17 = Res_0603: Supplier Footprint: 0603
R13 R14 R18 = CUM2512-24FR010: 阻值:10mΩ;精度:±1%;功率:2W;温度系数:±50ppm/℃;; LCSC Part Name: 10mΩ ±1% 2W; Supplier Part: C323772; Manufacturer: FORT(致强); Supplier Footprint: 2512; JLCPCB Part Class: 扩展库; Datasheet: https://atta.szlcsc.com/upload/public/pdf/source/20190109/C323782_06346C497617E23BE6CF56B9D44E903E.pdf; Supplier: LCSC; Tolerance: ±1%; Power(Watts): 2W; Temperature Coefficient: ±50ppm/℃
U5 = AS5600-ASOT: 旋转角度范围:0°~360°;; Supplier Part: C499458; Manufacturer: ams(艾迈斯半导体); Supplier Footprint: SOIC-8; JLCPCB Part Class: 扩展库; Datasheet: https://atta.szlcsc.com/upload/public/pdf/source/20200324/C499458_E1461AFB0CE1042DE5756821C534625C.pdf; Supplier: LCSC; Supply Voltage: 5V；3.3V; Rotation Angle: 0°~360°
U6 U7 = INA240A2PWR: 放大器数:单路;; Supplier Part: C129949; Manufacturer: TI(德州仪器); Supplier Footprint: TSSOP-8; JLCPCB Part Class: 扩展库; Datasheet: https://www.ti.com/cn/lit/gpn/ina240; Supplier: LCSC; Number of Channels: 单路; Supply Current: 1.8mA; Operating Temperature: -40℃~+125℃
U8 = DRV8313PWPR: 驱动电机类型:无刷直流BLDC;电源电压:8V~60V;输出电流:-;接口:并行;; LCSC Part Name: 无刷直流BLDC电机驱动芯片 60V; Supplier Part: C92482; Manufacturer: TI(德州仪器); Supplier Footprint: HTSSOP-28-EP-4.5mm; JLCPCB Part Class: 扩展库; Datasheet: https://www.ti.com/cn/lit/gpn/drv8313; Supplier: LCSC; Drive motor type: 无刷直流BLDC; Supply Voltage: 8V~60V; Interface: 并行; Operating Temperature: -40℃~+150℃@(Tj)

## Nets
3V3: C13.2 C14.2 C15.1 C16.1 CN5.10 R10.2 R11.2 R15.2 R16.2 U5.1(VDD5V) U6.5(VS) U6.6(REF2) U7.5(VS) U7.6(REF2)
GND: C11.1 C12.2 C13.1 C14.1 C15.2 C16.2 CN5.1 CN6.1 LED4.1(K) LED6.1(K) R12.1 U5.4(GND) U5.8(DIR) U6.1(NC) U6.4(GND) U6.7(REF1) U7.1(NC) U7.4(GND) U7.7(REF1) U8.6(PGND1) U8.7(PGND2) U8.10(PGND3) U8.12(COMPP) U8.13(COMPN) U8.14(GND) U8.19(COMPO#) U8.20(GND) U8.21(NC) U8.28(GND) U8.29(EP)
VCC: C10.1 C11.2 CN6.2 R17.2 U8.4(VM) U8.11(VM)
A1: CN5.9 U6.8(OUT)
A3: CN5.8 U7.8(OUT)
EN: CN5.2 U8.22(EN3) U8.24(EN2) U8.26(EN1)
PWM1: CN5.3 U8.27(IN1)
PWM2: CN5.4 U8.25(IN2)
PWM3: CN5.5 U8.23(IN3)
SCL: CN5.7 R10.1 U5.7(SCL)
SDA: CN5.6 LED5.1(-) R11.1 U5.6(SDA)
U: R13.2 U6.2(IN+) U8.5(OUT1)
U_CS: CN4.1 R13.1 U6.3(IN-)
V: R18.1 U8.8(OUT2)
V_CS: CN4.2 R18.2
W: R14.1 U7.3(IN-) U8.9(OUT3)
W_CS: CN4.3 R14.2 U7.2(IN+)
Net-(C9-1): C9.1 U8.2(CP2)
Net-(C9-2): C9.2 U8.1(CP1)
Net-(C10-2): C10.2 U8.3(VCP)
Net-(C12-1): C12.1 U8.15(V3P3OUT) U8.16(RESET#) U8.17(SLEEP#)
Net-(LED4-2): LED4.2(A) R16.1
Net-(LED5-2): LED5.2(+) R15.1
Net-(LED6-2): LED6.2(A) R17.1
Net-(R12-2): R12.2 U5.5(PGO)

Not connected (* = marked no-connect by the designer): CN4 0; CN5 11 12; CN6 3 4; U5 2(VDD3V3) 3(OUT)*; U8 18(FAULT#)*

## Notes on the sheet
- AS5600 -- DIR
  接GND  -- 顺时针数值增加
  接VCC  -- 顺时针数值减小

# Board PCB1_1
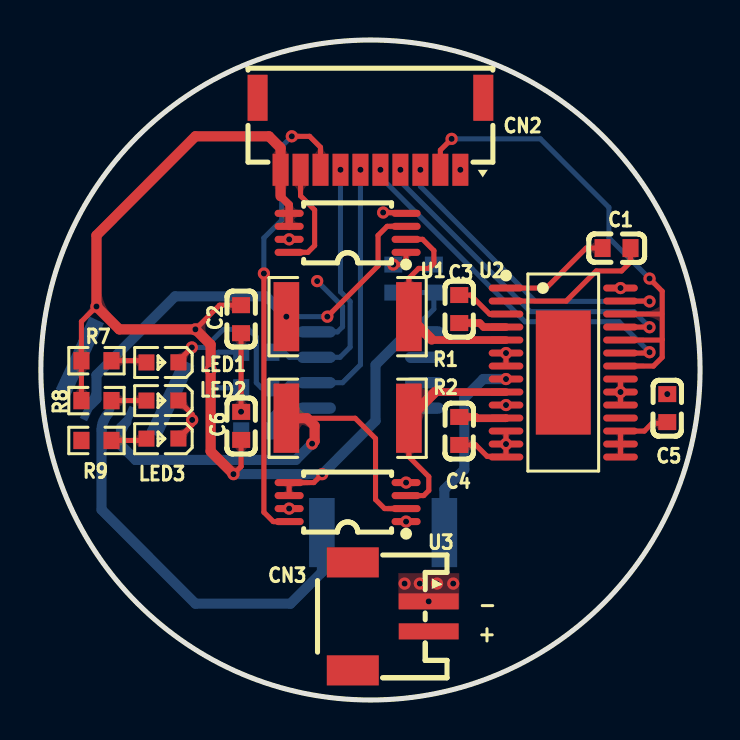
[diagram p2: board, top side]
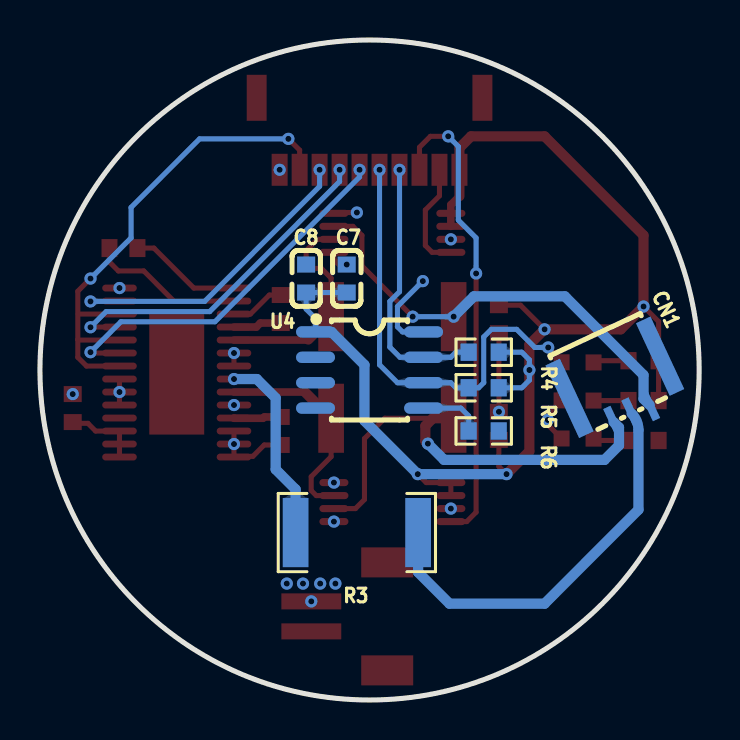
[diagram p3: board, bottom side, seen from below]

Outline 33 x 33 mm; copper layers: Top Layer, Bottom Layer. Coordinates in mm from the lower left corner of the outline.
Outline path: circle c16.5,16.5 r16.5
Stack: Top Layer 0.035mm / Dielectric1 1.51mm FR4 er 4.5 / Bottom Layer 0.035mm

## Design rules (mm)
template: 自定义配置
spacing copperThickness1oz (default): track to track 0.102, other pairs 0.152 to 0.3
spacing copperThickness2oz: track to track 0.203, other pairs 0.152 to 0.3
track width copperThickness1oz (default): min 0.127, default 0.254, max 2.54
track width copperThickness2oz: min 0.203, default 0.254, max 2.54
differential pair differentialPair (default): width min 0.127, default 0.254, max 2.54; gap min 0.152, default 0.152
via viaSize (default): diameter min 0.5, default 0.61, max 10; hole min 0.3, default 0.305, max 6.299
net GND uses copperRegion1

## Placement (name value [footprint] x y rotation side)
C1  0.01uF  [C0603]  28.82 22.6 180 top
C2  0.1uF  [C0603]  10.02 19.04 270 top
C3  0.1uF  [C0603]  20.94 19.55 90 top
C4  10uF  [C0603]  20.94 13.45 90 top
C5  0.47uF  [C0603]  31.36 14.59 90 top
C6  0.1uF  [C0603]  10.03 13.71 90 top
C7  0.1uF  [C0603]  17.64 21.07 270 bottom
C8  1uF  [C0603]  19.68 21.07 270 bottom
CN1  1.0T-3P卧贴  [CONN-SMD_1.0T-3P]  3.8 15.23 335 bottom
CN2  1.0-10P WT  [CONN-SMD_10P-P1.00_1.0-10P-WT]  16.5 28.31 180 top
CN3  HCZZ0323-2  [CONN-SMD_2P-P1.50_HCZZ0323-2]  17.52 4.18 270 top
LED1  NCD0603B1  [LED0603-RD]  6.09 16.88 180 top
LED2  NCD0603G1  [LED0603-RD]  6.09 14.98 180 top
LED3  NCD0603R1  [LED0603-RD_RED]  6.09 13.07 180 top
R1  10mΩ  [R2512]  15.36 19.17 0 top
R2  10mΩ  [R2512]  15.36 14.09 180 top
R3  10mΩ  [R2512]  17.13 8.37 180 bottom
R4  10K  [R0603]  10.78 17.39 180 bottom
R5  10K  [R0603]  10.78 15.61 180 bottom
R6  1K  [R0603]  10.78 13.45 0 bottom
R7  10K  [R0603]  2.78 16.97 180 top
R8  10K  [R0603]  2.78 14.97 180 top
R9  10K  [R0603]  2.78 12.98 180 top
U1  INA240A2PWR  [TSSOP-8_L4.4-W3.0-P0.65-LS6.4-BL]  15.36 23.36 90 top
U2  DRV8313PWPR  [HTSSOP-28_L9.8-W4.5-P0.65-LS6.6-BL-EP]  26.15 16.37 270 top
U3  INA240A2PWR  [TSSOP-8_L4.4-W3.0-P0.65-LS6.4-BL]  15.36 9.9 90 top
U4  AS5600-ASOT  [SOIC-8_L5.0-W4.0-P1.27-LS6.0-BL]  16.5 16.5 270 bottom

## Footprints (pads in the part's own frame, mm; a bottom-side part is the same pattern mirrored in y, then rotated)
C0603
  rect 0.8x0.9 smd: 1(-0.7,0) 2(0.7,0)
CONN-SMD_1.0T-3P
  rect 0.8x4 smd: 0(-2.501,-0.999) 0(2.501,-1)
  rect 0.4x1.6 smd: 1(-0.999,1) 2(0.001,1) 3(1.001,1)
CONN-SMD_2P-P1.50_HCZZ0323-2
  rect 0.8x3 smd: 1(-0.75,1.9) 2(0.75,1.9)
  rect 1.5x2.6 smd: 3(-2.7,-1.9) 4(2.7,-1.9)
CONN-SMD_10P-P1.00_1.0-10P-WT
  rect 0.8x1.6 smd: 1(-4.5,1.8) 2(-3.5,1.8) 3(-2.5,1.8) 4(-1.5,1.8) 5(-0.5,1.8) 6(0.5,1.8) 7(1.5,1.8) 8(2.5,1.8) 9(3.5,1.8) 10(4.5,1.8)
  rect 1x2.3 smd: 11(5.65,-1.8) 12(-5.65,-1.8)
HTSSOP-28_L9.8-W4.5-P0.65-LS6.6-BL-EP
  oval 0.343x1.732 smd: 1(-4.225,-2.866) 2(-3.575,-2.866) 3(-2.925,-2.866) 4(-2.275,-2.866) 5(-1.625,-2.866) 6(-0.975,-2.866) 7(-0.325,-2.866) 8(0.325,-2.866) 9(0.975,-2.866) 10(1.625,-2.866) 11(2.275,-2.866) 12(2.925,-2.866) 13(3.575,-2.866) 14(4.225,-2.866) 15(4.225,2.866) 16(3.575,2.866) 17(2.925,2.866) 18(2.275,2.866) 19(1.625,2.866) 20(0.975,2.866) 21(0.325,2.866) 22(-0.325,2.866) 23(-0.975,2.866) 24(-1.625,2.866) 25(-2.275,2.866) 26(-2.925,2.866) 27(-3.575,2.866) 28(-4.225,2.866)
  rect 6.2x2.75 smd: 29(0,0)
LED0603-RD
  rect 0.8x0.8 smd: 1(-0.799,-0.004) 2(0.799,0.004)
LED0603-RD_RED
  rect 0.8x0.8 smd: 1(-0.799,-0.004) 2(0.799,0.004)
R0603
  rect 0.806x0.864 smd: 1(-0.753,0) 2(0.753,0)
R2512
  rect 1.282x3.456 smd: 1(-3.067,0) 2(3.067,0)
SOIC-8_L5.0-W4.0-P1.27-LS6.0-BL
  oval 0.569x1.95 smd: 1(-1.905,-2.705) 2(-0.635,-2.705) 3(0.635,-2.705) 4(1.905,-2.705) 5(1.905,2.705) 6(0.635,2.705) 7(-0.635,2.705) 8(-1.905,2.705)
TSSOP-8_L4.4-W3.0-P0.65-LS6.4-BL
  oval 0.353x1.454 smd: 1(-0.975,-2.927) 2(-0.325,-2.927) 3(0.325,-2.927) 4(0.975,-2.927) 5(0.975,2.927) 6(0.325,2.927) 7(-0.325,2.927) 8(-0.975,2.927)

## Nets
3V3: C2.1 C6.1 C7.2 C8.2 CN2.10 R4.2 R5.2 R7.2 R8.2 U1.5 U1.6 U3.5 U3.6 U4.1
GND: C2.2 C4.1 C5.2 C6.2 C7.1 C8.1 CN2.1 CN3.1 LED2.1 LED3.1 R6.1 U1.1 U1.4 U1.7 U2.6 U2.7 U2.10 U2.12 U2.13 U2.14 U2.19 U2.20 U2.21 U2.28 U2.29 U3.1 U3.4 U3.7 U4.4 U4.8
VCC: C3.1 C4.2 CN3.2 R9.2 U2.4 U2.11
A1: CN2.9 U1.8
A3: CN2.8 U3.8
EN: CN2.2 U2.22 U2.24 U2.26
PWM1: CN2.3 U2.27
PWM2: CN2.4 U2.25
PWM3: CN2.5 U2.23
SCL: CN2.7 R4.1 U4.7
SDA: CN2.6 LED1.1 R5.1 U4.6
U: R1.2 U1.2 U2.5
U_CS: CN1.1 R1.1 U1.3
V: R3.1 U2.8
V_CS: CN1.2 R3.2
W: R2.1 U2.9 U3.3
W_CS: CN1.3 R2.2 U3.2
$1N1716: C1.1 U2.2
$1N1719: C1.2 U2.1
$1N1771: C3.2 U2.3
$1N2236: C5.1 U2.15 U2.16 U2.17
$1N2690: R6.2 U4.5
$1N4457: LED2.2 R8.1
$1N4564: LED1.2 R7.1
$1N4687: LED3.2 R9.1

Pads without a net: CN1 0; CN2 11 12; CN3 3 4; U2 18; U4 2 3

## Via types
v1: diameter 0.61, hole 0.305, Top Layer to Bottom Layer, 43 vias

## Routing (per net, layer and track width the routed paths; a pad name or vN(x,y) marks a point on that pad's centre or on a via; arc(x,y) is an arc through that point)
3V3: length 67.5
  Top Layer w0.254: v1(9.64,11.29) 10.03,11.68 10.03,13 ; v1(7.74,18.53) 8.94,19.74 C2.1 ; R8.2 R7.2 2.03,18.92 v1(2.78,19.67) ; U3.6 U3.5 13.66,10.87 v1(14.09,11.29)
  Top Layer w0.381: 12,25.19 12.43,24.76 U1.5 U1.6
  Top Layer w0.508: 12,25.19 CN2.10 12,27.6 11.42,28.18 7.74,28.18 2.78,23.23 v1(2.78,19.67) 3.93,18.53 v1(7.74,18.53) 8.5,17.77 v1(8.5,16.5) 8.5,12.44 v1(9.64,11.29)
  Bottom Layer w0.254: R4.2 8.88,17.39 8.5,17.01 v1(8.5,16.5) 8.5,15.99 8.88,15.61 R5.2 ; C7.2 C8.2 19.68,19.55 19.21,19.08 U4.1
  Bottom Layer w0.508: v1(9.64,11.29) v1(14.09,11.29) 16.75,13.96 16.75,16.75 18.41,18.41 U4.1
GND: length 18.7
  Top Layer w0.254: C4.1 21.77,12.75 22.34,12.18 23.25,12.18 U2.14 v1(23.29,12.8) U2.12 ; C6.2 v1(10.02,14.41) C2.2 ; LED2.1 7.58,14.29 v1(7.58,14) 7.58,13.76 LED3.1 ; v1(17.13,24.37) 18.24,24.37 U1.4 ; v1(23.29,17.35) U2.7 ; U2.19 v1(29.02,15.4) U2.21 ; v1(17.64,21.77) 18.03,21.77 18.28,22.02 18.28,22.38 U1.1
  Bottom Layer w0.254: U4.8 14.85,18.41 15.1,18.66 15.1,19.67 v1(13.83,20.94)
  vias: v1(12.43,23.03) v1(12.43,9.57) v1(18.21,5.82) v1(18.28,10.87) v1(18.28,8.92) v1(18.97,5.82) v1(19.42,4.93) v1(19.83,5.82) v1(20.64,5.82) v1(21,26.51) v1(23.29,14.75) v1(29.02,20.6) v1(31.36,15.3)
VCC: length 4.8
  Top Layer w0.381: U2.11 23.28,14.09 21.83,14.09 21.77,14.15 C4.2 ; C3.1 21.97,18.85 22.17,18.65 U2.4
A1: length 5.5
  Top Layer w0.254: CN2.9 13,25.21 13.71,24.5 13.71,22.72 13.37,22.38 U1.8
A3: length 23.6
  Top Layer w0.254: U3.8 11.63,8.92 11.17,9.39 v1(11.17,21.33) ; v1(12.56,28.18) 13.45,28.18 14,27.64 CN2.8
  Bottom Layer w0.254: v1(11.17,21.33) 11.17,23.1 12.06,23.99 12.06,27.68 v1(12.56,28.18)
EN: length 26.1
  Top Layer w0.254: v1(20.56,28.06) 20,27.49 CN2.2 ; U2.24 31.08,18 31.1,18.02 ; 31.1,18.02 31.1,20.44 v1(30.47,21.07) ; 31.1,18.02 31.1,17.14 30.67,16.7 U2.22 ; 31.08,19.3 U2.26
  Bottom Layer w0.254: v1(30.47,21.07) 28.44,23.1 28.44,24.63 25.01,28.06 v1(20.56,28.06)
PWM1: length 16.1
  Top Layer w0.254: v1(30.47,19.93) 30.45,19.95 U2.27
  Bottom Layer w0.254: v1(19,26.51) 19,25.68 24.75,19.93 v1(30.47,19.93)
PWM2: length 17.5
  Top Layer w0.254: v1(30.47,18.64) 30.46,18.65 U2.25
  Bottom Layer w0.254: v1(30.47,18.64) 29.69,19.42 24.5,19.42 18,25.92 v1(18,26.51)
PWM3: length 18.9
  Top Layer w0.254: v1(30.47,17.39) 30.43,17.35 U2.23
  Bottom Layer w0.254: v1(30.47,17.39) 28.95,18.91 24.24,18.91 17,26.15 v1(17,26.51)
SCL: length 13.3
  Bottom Layer w0.254: v1(15,26.51) 15,20.41 15.48,19.93 15.48,17.64 14.98,17.14 U4.7 12.44,17.14 12.18,17.39 R4.1
SDA: length 22.6
  Top Layer w0.254: v1(7.56,17.63) 6.89,16.95 LED1.1
  Bottom Layer w0.254: v1(7.56,17.63) 8.23,17.63 9.13,18.53 10.4,18.53 10.78,18.15 10.78,15.86 11.04,15.61 R5.1 12.18,15.61 12.44,15.86 U4.6 15.1,15.86 16,16.76 v1(16,26.51)
U: length 11.1
  Top Layer w0.254: U1.2 19.11,23.03 19.68,22.47 19.68,21.83 19.42,21.58 18.91,21.58 18.42,21.09 R1.2
  Top Layer w0.381: 19.59,18 U2.5
  Top Layer w0.508: R1.2 19.57,18.02
U_CS: length 21.9
  Top Layer w0.254: U1.3 17.33,23.68 16.88,23.23 16.88,21.71 v1(14.34,19.17)
  Bottom Layer w0.254: v1(14.34,19.17) v1(12.29,19.17)
  Bottom Layer w0.508: CN1.1 2.78,15.06 2.78,16.25 6.72,20.18 11.27,20.18 v1(12.29,19.17)
V: length 9.6
  Bottom Layer w0.508: v1(23.29,16.05) 22.14,16.05 21.2,15.1 21.2,11.53 20.2,10.53 R3.1
V_CS: length 20.5
  Bottom Layer w0.508: R3.2 14.07,6.39 12.5,4.82 7.74,4.82 3.04,9.52 3.04,13.5 arc(3.13,13.95) CN1.2
W: length 10.7
  Top Layer w0.254: R2.1 18.42,12.16 19.42,11.17 19.42,10.47 19.17,10.22 U3.3
  Top Layer w0.381: 19.73,15.4 U2.9
  Top Layer w0.508: R2.1 19.73,15.4
W_CS: length 22.6
  Top Layer w0.254: U3.2 17.21,9.57 16.75,10.02 16.75,13.07 15.74,14.09 13.32,14.09
  Top Layer w0.508: v1(13.58,12.82) 13.71,12.94 13.71,13.71 13.32,14.09 R2.2
  Bottom Layer w0.508: CN1.3 4.01,13.63 4.01,12.73 4.74,12 12.77,12 v1(13.58,12.82)
$1N1716: length 7.7
  Top Layer w0.254: U2.2 26.3,19.95 27.8,21.45 29.07,21.45 29.52,21.9 29.52,22.6
$1N1719: length 5.7
  Top Layer w0.254: C1.2 27.29,22.6 25.3,20.6 U2.1
$1N1771: length 2.7
  Top Layer w0.254: U2.3 22.47,19.3 21.51,20.25 C3.2
$1N2236: length 3.8
  Top Layer w0.254: U2.15 U2.16 U2.17 30.21,13.45 30.6,13.83 31.3,13.83 C5.1
$1N2690: length 3.2
  Bottom Layer w0.254: R6.2 11.54,14.21 11.93,14.59 U4.5
$1N4457: length 1.7
  Top Layer w0.254: R8.1 5.28,14.97 LED2.2
$1N4564: length 1.8
  Top Layer w0.254: R7.1 5.2,16.97 LED1.2
$1N4687: length 1.8
  Top Layer w0.254: R9.1 5.19,12.98 LED3.2

## Copper pours and planes (outline as drawn; the poured copper is in the pictures)
GND on Top Layer: 17.9,6.34 20.94,6.34 20.94,4.56 17.9,4.56
GND on Bottom Layer: -6.36,41.52 40.76,41.52 40.76,-7 -6.36,-7
VCC on Top Layer: -4.96,38.85 39.87,38.85 39.87,-5.47 -4.96,-5.47

Small or netless copper shapes (teardrops, artwork), in the pictures only: 101 on Top Layer, 36 on Bottom Layer

## Text on the board
Top Silkscreen Layer: + | -

# Board PCB1
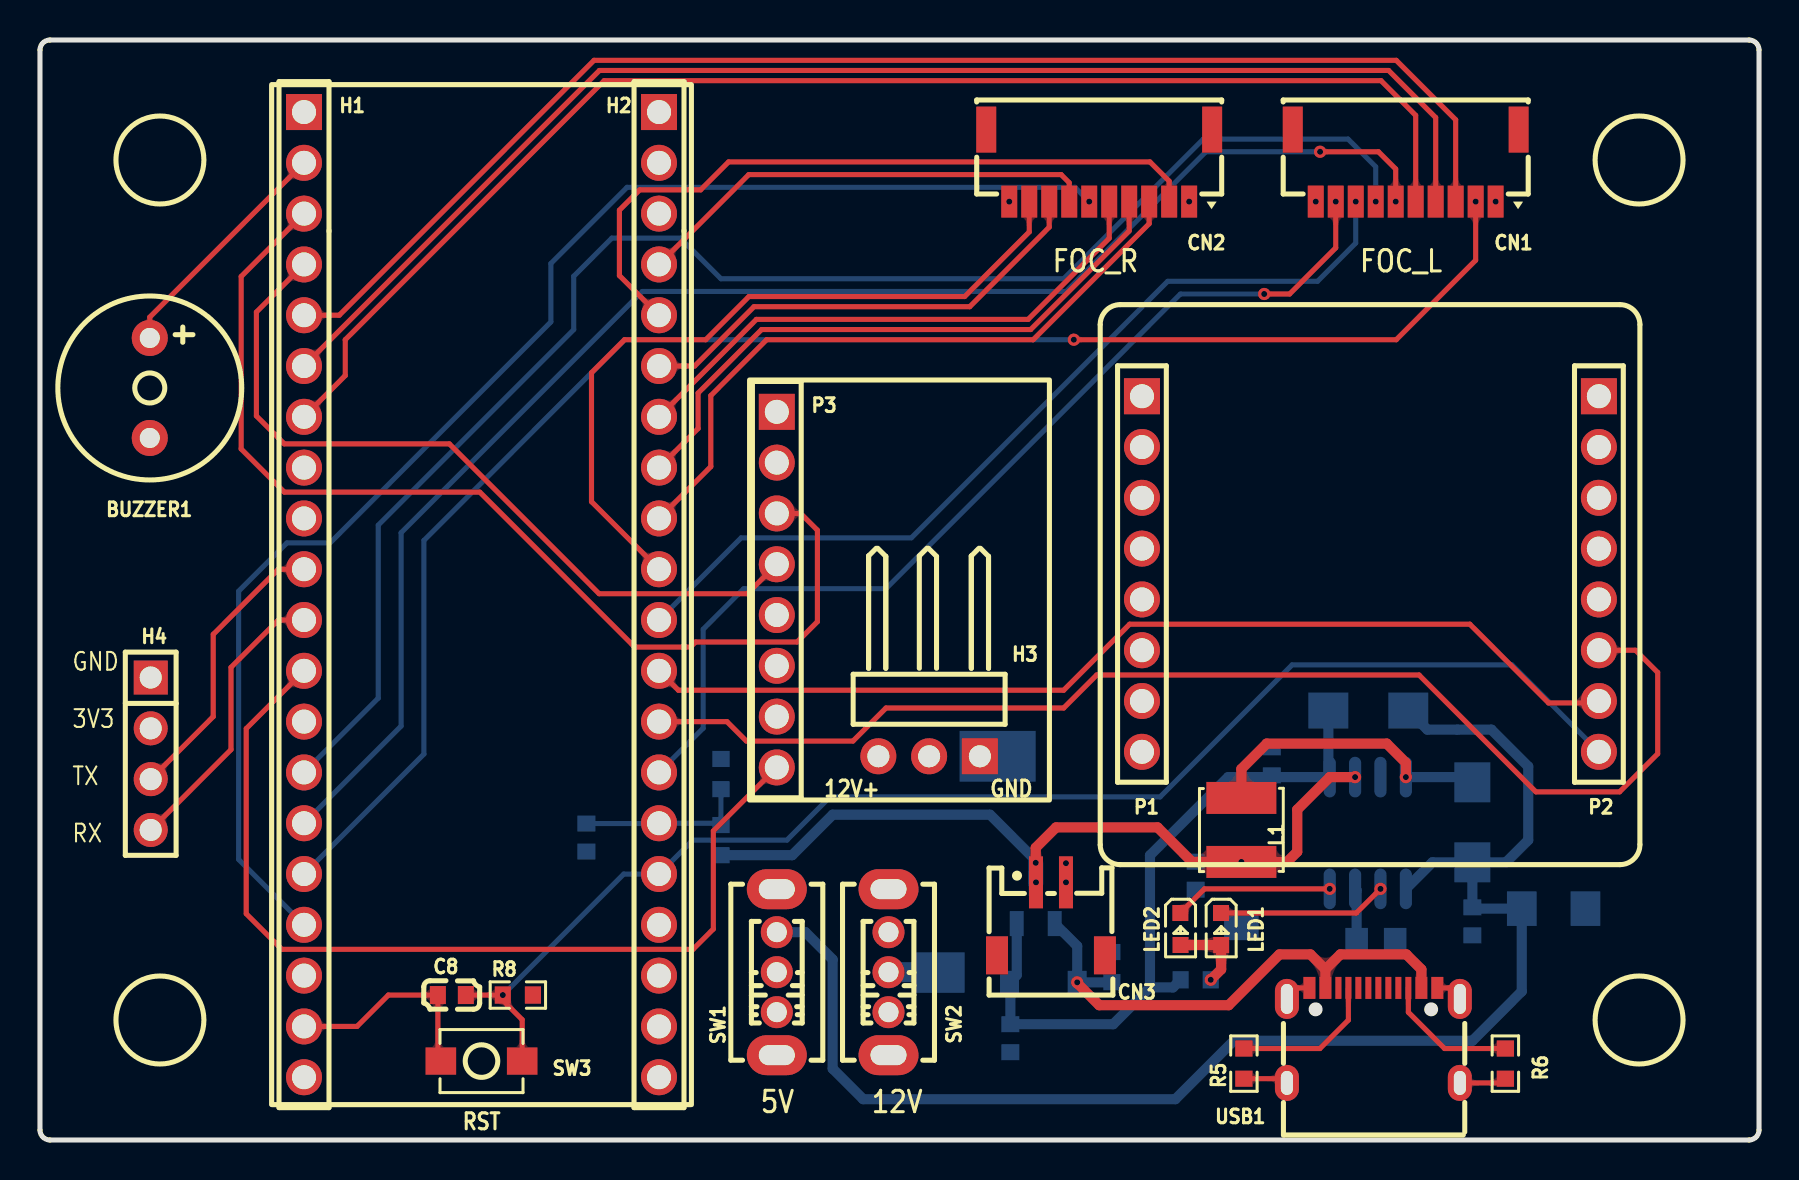
[diagram p4: board, top side]
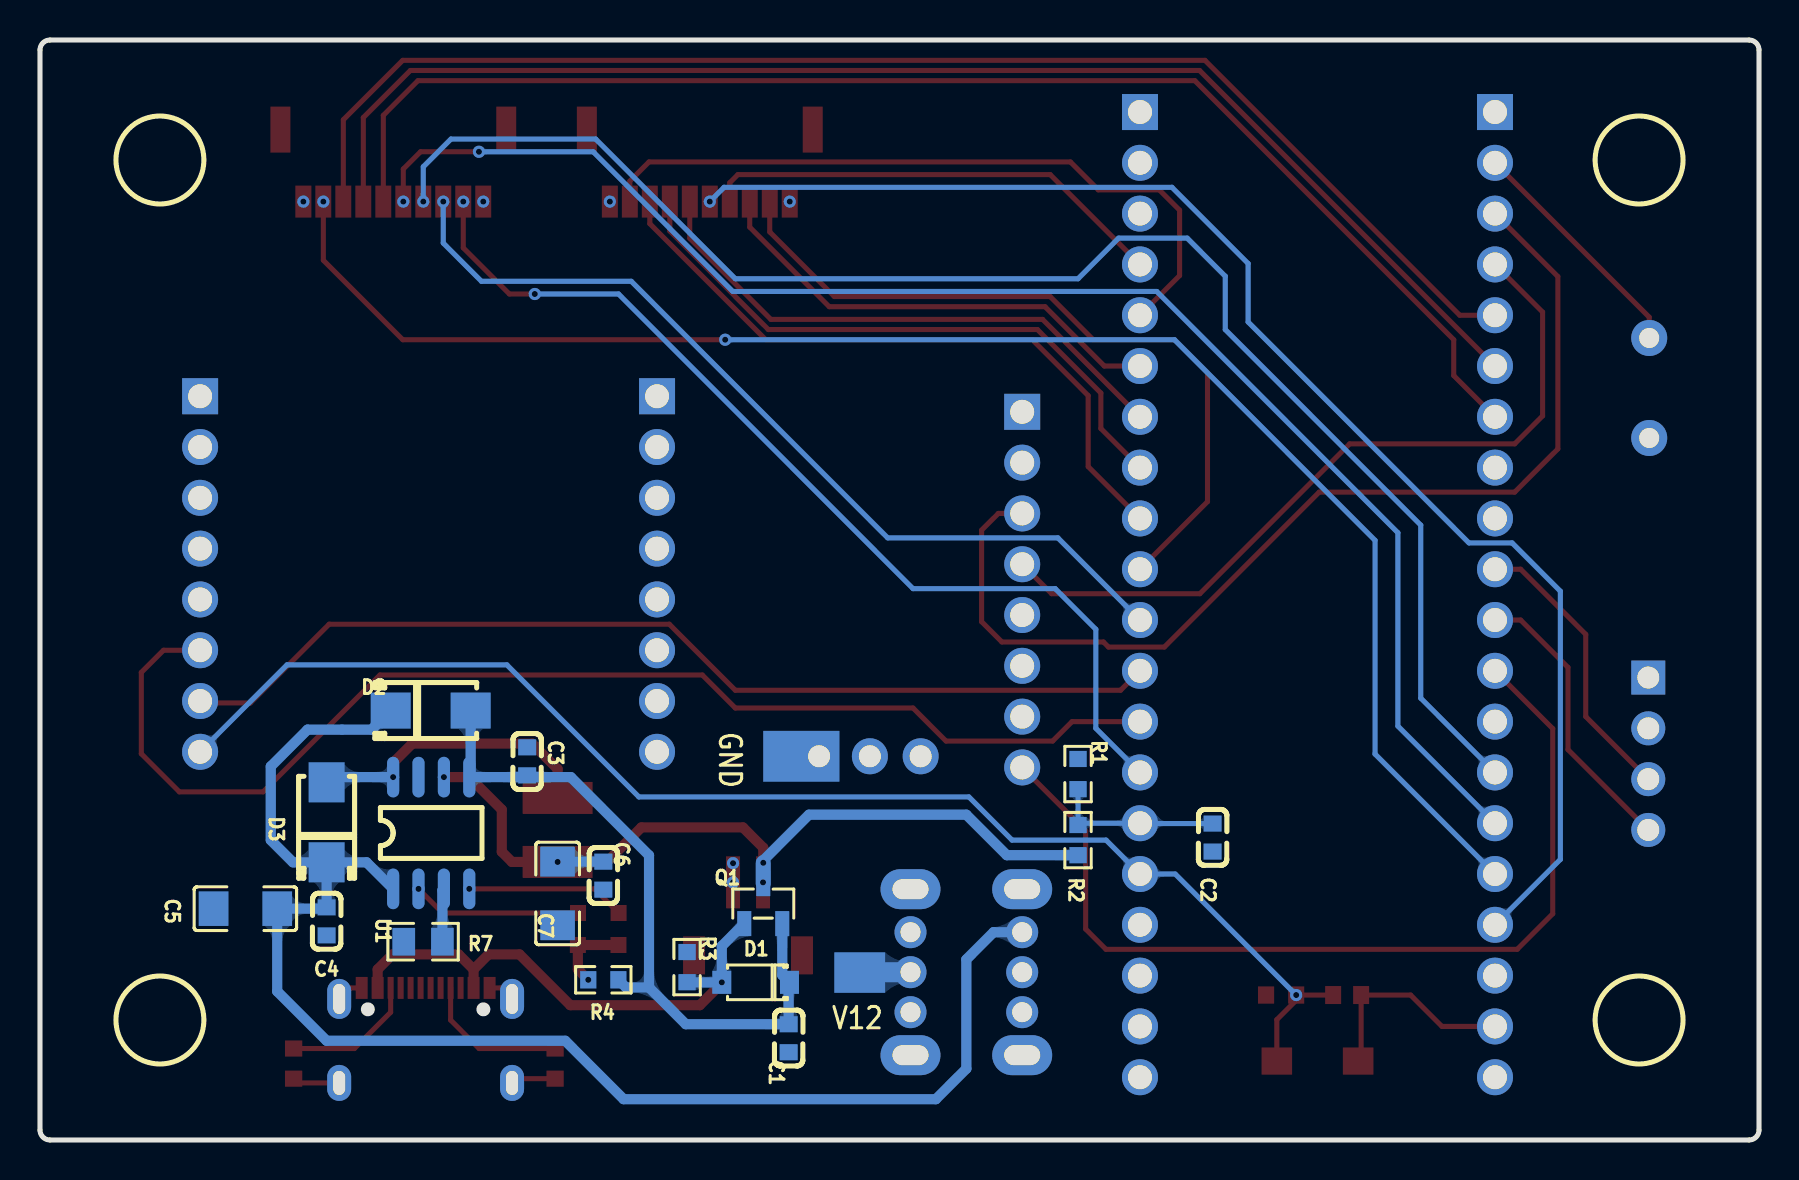
[diagram p5: board, bottom side, seen from below]

Outline 86 x 55 mm; copper layers: Top Layer, Inner1, Inner2, Bottom Layer. Coordinates in mm from the lower left corner of the outline.
Outline path: 0,54.5 0,0.5 arc(0.15,0.15) 0.5,0 85.5,0 arc(85.85,0.15) 86,0.5 86,54.5 arc(85.85,54.85) 85.5,55 0.5,55 arc(0.15,54.85) 0,54.5
Stack: Top Layer 0.035mm 外层铜厚1oz / Dielectric1 0.2104mm 7628 RC49% 8.6mil / Inner1 0.0152mm 内层铜厚 / Dielectric2 1.065mm 1.1mm H/HOZ 含铜 / Inner2 0.0152mm 内层铜厚 / Dielectric3 0.2104mm 7628 RC49% 8.6mil / Bottom Layer 0.035mm 外层铜厚1oz

## Design rules (mm)
template: 自定义配置
spacing copperThickness1oz (default): track to track 0.102, other pairs 0.152 to 0.3
spacing copperThickness2oz: track to track 0.203, other pairs 0.152 to 0.3
track width copperThickness1oz (default): min 0.127, default 0.254, max 2.54
track width copperThickness2oz: min 0.203, default 0.254, max 2.54
differential pair differentialPair (default): width min 0.127, default 0.254, max 2.54; gap min 0.152, default 0.152
via viaSize (default): diameter min 0.5, default 0.61, max 10; hole min 0.3, default 0.305, max 6.299
net 12V uses V12

## Placement (name value [footprint] x y rotation side)
BUZZER1  2700Hz  [BUZ-TH_BD9.0-P5.00-D0.6-FD]  5.49 37.6 270 top
C1  100uF  [C0603]  48.55 5.09 270 bottom
C2  100nF  [C0603_1]  27.34 15.12 270 bottom
C3  10uF  [C0603]  61.63 18.93 90 bottom
C4  100nF  [C0603]  71.66 10.93 270 bottom
C5  22uF  [C1206]  75.72 11.57 180 bottom
C6  100nF  [C0603]  57.82 13.22 270 bottom
C7  22uF  [C1206]  60.1 12.33 90 bottom
C8  100nF  [C0603]  20.61 7.25 0 top
CN1  1.0-10P WT  [CONN-SMD_10P-P1.00_1.0-10P-WT]  68.32 48.72 180 top
CN2  1.0-10P WT  [CONN-SMD_10P-P1.00_1.0-10P-WT]  52.99 48.72 180 top
CN3  1.5-2P WT  [CONN-SMD_1.5-2P-WT]  50.58 11.06 180 top
D1  B5819W  [SOD-123_L2.8-W1.8-LS3.7-RD]  50.2 7.88 0 bottom
D2  -  [SMA_L4.2-W2.7-LS5.0-RD]  66.45 21.47 180 bottom
D3  -  [SMA_L4.2-W2.7-LS5.0-RD]  71.66 15.88 90 bottom
H1  22850120ANG1SYA01  [HDR-TH_20P-P2.54-V-F]  13.21 27.27 270 top
H2  22850120ANG1SYA01  [HDR-TH_20P-P2.54-V-F]  30.97 27.27 270 top
H3  PZ254R-11-03P  [HDR-TH_3P-P2.54-H-M-W10.4]  44.48 19.19 180 top
H4  PZ254V-11-04P  [HDR-TH_4P-P2.54-V-M]  5.54 19.31 270 top
L1  4.7uH  [IND-SMD_L4.0-W4.0]  60.1 15.5 90 top
LED1  19-217/R6C-AL1M2VY/3T  [LED0603-RD]  59.09 10.55 270 top
LED2  19-217/GHC-YR1S2/3T  [LED0603-RD]  57.05 10.55 270 top
NOREF  -  [Pad_e7059]  44.99 8.37 0 top
NOREF#2  -  [Pad_e7058]  47.91 19.19 0 top
P1  2.54-1*8P母环保  [HDR-TH_8P-P2.54-V-F-1]  55.13 28.3 270 top
P2  2.54-1*8P母环保  [HDR-TH_8P-P2.54-V-F-1]  77.99 28.3 270 top
P3  2.54-1*8P母环保  [HDR-TH_8P-P2.54-V-F-1]  36.86 27.52 270 top
Q1  AO3401A  [SOT-23-3_L2.9-W1.3-P1.90-LS2.4-BR]  49.82 11.82 270 bottom
R1  1K  [R0603_1]  34.07 18.3 90 bottom
R2  10K  [R0603]  34.07 15 90 bottom
R3  100K  [R0603]  53.63 8.64 270 bottom
R4  1kΩ  [R0603]  57.82 8.01 180 bottom
R5  5.1K  [R0603]  60.23 3.82 90 top
R6  5.1K  [R0603]  73.31 3.82 90 top
R7  680Ω  [R0805]  66.83 9.92 180 bottom
R8  10K  [R0603]  23.91 7.25 0 top
SW1  SS12D07VG5 087  [SW-TH_SS12D07VG4]  36.86 8.39 90 top
SW2  SS12D07VG5 087  [SW-TH_SS12D07VG4]  42.45 8.39 90 top
SW3  TS342A2P-WZ  [SW-SMD_L4.0-W2.9-LS5.0]  22.09 3.95 0 top
U1  -  [TP5410_SOP8]  68.36 12.58 90 bottom
USB1  TYPE-C 16PIN 2MD(073)  [USB-C-SMD_TYPE-C-6PIN-2MD-073]  66.71 5.23 0 top

## Footprints (pads in the part's own frame, mm; a bottom-side part is the same pattern mirrored in y, then rotated)
BUZ-TH_BD9.0-P5.00-D0.6-FD
  round 1.8 hole 1: 1(-2.5,0) 2(2.5,0)
C0603
  rect 0.8x0.9 smd: 1(-0.7,0) 2(0.7,0)
C0603_1
  rect 0.8x0.9 smd: 1(-0.7,0) 2(0.7,0)
C1206
  rect 1.485x1.728 smd: 1(-1.593,0) 2(1.593,0)
CONN-SMD_1.5-2P-WT
  rect 0.7x2.6 smd: 1(0.75,-1.825) 2(-0.75,-1.825)
  rect 1.1x1.9 smd: 3(-2.7,1.825) 4(2.7,1.825)
CONN-SMD_10P-P1.00_1.0-10P-WT
  rect 0.8x1.6 smd: 1(-4.5,1.8) 2(-3.5,1.8) 3(-2.5,1.8) 4(-1.5,1.8) 5(-0.5,1.8) 6(0.5,1.8) 7(1.5,1.8) 8(2.5,1.8) 9(3.5,1.8) 10(4.5,1.8)
  rect 1x2.3 smd: 11(5.65,-1.8) 12(-5.65,-1.8)
HDR-TH_3P-P2.54-H-M-W10.4
  rect 1.8x1.8 hole 1.1: 1(-2.54,0)
  round 1.8 hole 1.1: 2(0,0) 3(2.54,0)
HDR-TH_4P-P2.54-V-M
  rect 1.7x1.7 hole 1.1: 1(-3.81,0)
  round 1.7 hole 1.1: 2(-1.27,0) 3(1.27,0) 4(3.81,0)
HDR-TH_8P-P2.54-V-F-1
  rect 1.8x1.8 hole 1.2: 1(-8.89,0)
  round 1.8 hole 1.2: 2(-6.35,0) 3(-3.81,0) 4(-1.27,0) 5(1.27,0) 6(3.81,0) 7(6.35,0) 8(8.89,0)
HDR-TH_20P-P2.54-V-F
  rect 1.8x1.8 hole 1.2: 1(-24.13,0)
  round 1.8 hole 1.2: 2(-21.59,0) 3(-19.05,0) 4(-16.51,0) 5(-13.97,0) 6(-11.43,0) 7(-8.89,0) 8(-6.35,0) 9(-3.81,0) 10(-1.27,0) 11(1.27,0) 12(3.81,0) 13(6.35,0) 14(8.89,0) 15(11.43,0) 16(13.97,0) 17(16.51,0) 18(19.05,0) 19(21.59,0) 20(24.13,0)
IND-SMD_L4.0-W4.0
  rect 1.6x3.5 smd: 1(-1.6,0) 2(1.6,0)
LED0603-RD
  rect 0.8x0.8 smd: 1(-0.799,-0.004) 2(0.799,0.004)
Pad_e7058
  custom 3.81x2.54 smd far side: 21(0,0)
Pad_e7059
  custom 2.54x2.027 smd far side: 22(0,0)
R0603
  rect 0.806x0.864 smd: 1(-0.753,0) 2(0.753,0)
R0603_1
  rect 0.807x0.864 smd: 1(-0.754,0) 2(0.754,0)
R0805
  rect 1.133x1.377 smd: 1(-0.966,0) 2(0.966,0)
SMA_L4.2-W2.7-LS5.0-RD
  rect 2x1.8 smd: 1(-2,0) 2(2,0)
SOD-123_L2.8-W1.8-LS3.7-RD
  rect 0.95x1.15 smd: 1(-1.692,0) 2(1.692,0)
SOT-23-3_L2.9-W1.3-P1.90-LS2.4-BR
  rect 1.25x0.7 smd: 1(1,-0.95) 2(1,0.95) 3(-1,0)
SW-SMD_L4.0-W2.9-LS5.0
  rect 1.53x1.36 smd: 1(-2.035,0) 2(2.035,0)
SW-TH_SS12D07VG4
  oval 1.6x1.6 hole 1: 1(-2,0) 2(0,0) 3(2,0)
  oval 2x3 hole 1x1.8: 4(4.15,0) 5(-4.15,0)
TP5410_SOP8
  oval 2.032x0.61 smd: 1(-0.025,-0.025) 2(-0.025,-1.296) 3(-0.025,-2.566) 4(-0.025,-3.836) 5(5.562,-3.836) 6(5.562,-2.566) 7(5.562,-1.296) 8(5.562,-0.025)
USB-C-SMD_TYPE-C-6PIN-2MD-073
  rect 0.6x1.1 smd: 1(-3.2,2.375) 2(-2.4,2.375) 11(2.4,2.375) 12(3.2,2.375)
  rect 0.3x1.1 smd: 3(-1.75,2.375) 4(-1.25,2.375) 5(-0.75,2.375) 6(-0.25,2.375) 7(0.25,2.375) 8(0.75,2.375) 9(1.25,2.375) 10(1.75,2.375)
  oval 1.2x2 hole 0.6x1.5: 13(-4.325,1.825) 14(4.325,1.825)
  oval 1.2x1.8 hole 0.6x1.2: 13(-4.325,-2.375) 14(4.325,-2.375)

## Nets
As in the schematic, except:
GND: BUZZER1.2 C1.2 C2.2 C3.2 C4.2 C5.1 C6.2 C7.1 C8.1 CN1.1 CN2.1 CN3.2 H1.19 H2.2 H3.1 H4.1 NOREF#2.21 P1.2 P2.4 P3.2 R1.2 R3.1 R5.1 R6.1 R7.1 SW3.1 U1.7 USB1.1 USB1.12 USB1.13 USB1.14
V12: NOREF.22 SW2.2

Pads without a net: CN1 11 12; CN2 11 12; CN3 3 4; H3 2; P2 5; SW1 1 4 5; SW2 1 4 5; USB1 3 5 6 7 8 9

## Via types
v1: diameter 0.61, hole 0.305, Top Layer to Bottom Layer, 25 vias

## Routing (per net, layer and track width the routed paths; a pad name or vN(x,y) marks a point on that pad's centre or on a via; arc(x,y) is an arc through that point)
3V3:
  vias: v1(48.49,46.92) v1(63.82,46.92)
GND: length 18
  Top Layer w0.254: USB1.1 62.93,7.6 USB1.13 ; R5.1 62.17,3.07 USB1.13 ; USB1.14 73.1,2.85 R6.1 ; SW3.1 19.91,4.09 C8.1 17.43,7.25 15.86,5.68 H1.19 ; USB1.12 70.48,7.6 USB1.14
  vias: v1(51.33,13.84) v1(51.33,12.88) v1(57.49,46.92) v1(72.82,46.92)
V12: length 2.4
  Bottom Layer w1: SW2.2 44.86,8.39 44.87,8.39
VBAT: length 41.8
  Top Layer w0.508: v1(49.82,13.86) 49.82,14.61 50.83,15.63 55.91,15.63 57.64,13.9 v1(60.1,13.9) 62.39,13.9 62.9,14.41 62.9,16.52 64.52,18.14 v1(65.79,18.14)
  Bottom Layer w0.508: C7.2 60.1,13.92 C6.1 ; v1(49.82,13.86) 49.82,13.98 47.53,16.27 39.66,16.27 37.63,14.24 R2.1
  Bottom Layer w0.75: v1(49.82,13.86) Q1.3
  vias: v1(49.83,12.88)
VBUS: length 26.7
  Top Layer w0.508: 64.31,8.53 63.56,9.28 62.01,9.28 59.47,6.74 52.99,6.74 51.89,7.84 v1(51.89,7.88) ; 64.31,8.53 65.06,9.28 68.36,9.28 69.11,8.53 USB1.11 ; 64.31,8.53 USB1.2
  Bottom Layer w0.508: Q1.1 51.89,9.7 v1(51.89,7.88) 53.62,7.88 R3.2
VIN: length 35.2
  Bottom Layer w0.508: 55.53,7.63 56.68,7.63 R4.2 ; 55.53,7.63 55.53,14.23 59.44,18.14 U1.5 64.45,18.21 D2.2 ; 55.53,7.63 53.69,5.79 C1.1 48.55,7.84 D1.1 48.87,8.24 Q1.2
BAT_ADC: length 8.6
  Bottom Layer w0.254: C2.1 30.95,15.82 H2.15 33.98,15.84 R2.2 R1.1
BUZZER: length 12
  Top Layer w0.254: H1.2 5.49,41.14 BUZZER1.1
ESP_RST: length 69.1
  Top Layer w0.254: 22.89,7.25 24.12,6.02 SW3.2 ; 22.89,7.25 C8.2 ; 22.89,7.25 v1(23.15,7.25)
  Bottom Layer w0.254: v1(23.15,7.25) 29.2,13.3 H2.16 32.67,15 37.37,15 39.53,17.15 56.04,17.15 62.64,23.76 73.64,23.76 P2.8
ESP_U0RX: length 62.4
  Top Layer w0.254: H2.13 34.37,20.92 35.34,19.95 40.67,19.95 42.32,21.6 51.21,21.6 52.86,23.25 68.99,23.25 74.83,17.41 79.03,17.41 80.93,19.31 80.93,23.38 79.82,24.49 P2.6
ESP_U0TX: length 50.5
  Top Layer w0.254: H2.12 31.94,22.49 51.21,22.49 54.52,25.79 71.53,25.79 75.47,21.85 77.89,21.85 P2.7
FOC_L_EN: length 80.5
  Top Layer w0.254: v1(71.82,46.92) 71.82,43.99 67.85,40.01 v1(51.72,40.01)
  Bottom Layer w0.254: v1(51.72,40.01) 29.24,40.01 19.21,29.98 19.21,19.3 H1.16
FOC_L_IA1: length 49.9
  Top Layer w0.254: v1(64.82,46.92) 64.82,44.61 62.52,42.3 v1(61.25,42.3)
  Bottom Layer w0.254: v1(61.25,42.3) 57.05,42.3 42.32,27.57 35.21,27.57 33.18,25.54 33.18,20.59 H2.14
FOC_L_IA3: length 44.7
  Bottom Layer w0.254: v1(65.82,46.92) 65.82,44.85 63.91,42.94 56.42,42.94 43.59,30.11 35.08,30.11 H2.11
FOC_L_PWM1: length 68.2
  Top Layer w0.254: CN1.3 70.82,51.01 67.85,53.98 27.72,53.98 14.97,41.24 H1.5
FOC_L_PWM2: length 67.9
  Top Layer w0.254: CN1.4 69.82,51.12 67.47,53.48 27.99,53.48 H1.6
FOC_L_PWM3: length 68.7
  Top Layer w0.254: H1.7 15.27,38.22 15.27,40.01 28.23,52.97 67.09,52.97 68.82,51.23 CN1.5
FOC_L_SCL: length 77.4
  Bottom Layer w0.254: v1(66.82,46.92) 66.82,48.66 65.44,50.05 58.2,50.05 51.21,43.06 34.07,43.06 32.04,45.09 28.61,45.09 26.7,43.19 26.7,40.52 16.92,30.74 16.92,22.09 H1.14
FOC_L_SDA: length 76.2
  Top Layer w0.254: v1(64.04,49.41) 66.96,49.41 67.82,48.55 v1(67.82,46.92)
  Bottom Layer w0.254: H1.15 18.07,20.7 18.07,30.36 30.13,42.43 51.34,42.43 58.33,49.41 v1(64.04,49.41)
FOC_R_EN: length 36
  Top Layer w0.254: H2.5 28.99,43.22 28.99,46.49 30,47.51 33.05,47.51 34.45,48.9 55.53,48.9 56.49,47.94 CN2.2
FOC_R_IA1: length 37.6
  Top Layer w0.254: CN2.9 49.49,45.4 46.26,42.17 35.46,42.17 33.31,40.01 29.24,40.01 27.59,38.36 27.59,31.92 H2.10
FOC_R_IA3: length 23.7
  Top Layer w0.254: H2.6 32.75,38.7 35.72,41.67 46.51,41.67 50.49,45.64 CN2.8
FOC_R_PWM1: length 33.8
  Top Layer w0.254: H2.9 33.56,33.67 33.56,37.22 36.35,40.01 49.69,40.01 55.49,45.82 CN2.3
FOC_R_PWM2: length 30.9
  Top Layer w0.254: H2.8 32.92,35.57 32.92,37.35 36.1,40.52 49.56,40.52 54.49,45.45 CN2.4
FOC_R_PWM3: length 28.1
  Top Layer w0.254: CN2.5 53.49,45.09 49.43,41.03 35.84,41.03 H2.7
FOC_R_SCL: length 23.5
  Top Layer w0.254: H2.4 35.46,48.27 51.09,48.27 51.49,47.86 CN2.7
FOC_R_SDA: length 71
  Bottom Layer w0.254: v1(52.49,46.92) 51.78,47.63 29.37,47.63 25.56,43.82 25.56,40.9 14.51,29.85 12.35,29.85 9.94,27.44 9.94,14.03 H1.17
MPU_INT: length 47.3
  Top Layer w0.254: H1.12 10.32,20.57 10.32,11.31 12.1,9.53 32.67,9.53 33.69,10.55 33.69,15.45 P3.8
MPU_SCL: length 53.5
  Top Layer w0.254: H1.3 10.06,43.17 10.06,34.55 12.22,32.39 22,32.39 29.75,24.65 32.54,24.65 32.8,24.9 37.88,24.9 38.89,25.92 38.89,30.49 38.05,31.33 P3.3
MPU_SDA: length 38.9
  Top Layer w0.254: P3.4 35.39,27.31 27.97,27.31 20.48,34.81 12.22,34.81 10.83,36.2 10.83,41.4 H1.4
STM32_PA15: length 14.4
  Top Layer w0.254: H1.10 11.92,28.54 8.67,25.28 8.67,21.17 H4.3
STM32_PB3: length 14.4
  Top Layer w0.254: H1.11 11.92,26 9.56,23.63 9.56,19.52 H4.4
VOUT: length 73.2
  Bottom Layer w0.508: D3.1 69.66,13.88 U1.1 ; D3.1 C4.1 71.73,11.57 C5.2 74.13,7.43 71.66,4.96 59.72,4.96 56.8,2.04 41.18,2.04 39.66,3.56 39.66,9.03 38.29,10.39 SW1.3 ; D3.1 71.66,14.11 ; D3.1 73.34,13.88 74.45,15 74.45,18.68 72.61,20.52 69.41,20.52 D2.1
$1N4508: length 7.4
  Top Layer w0.254: R5.2 64.03,4.57 65.46,6 USB1.4
$1N4509: length 6.8
  Top Layer w0.254: R6.2 70.27,4.57 68.46,6.39 USB1.10
$1N8495: length 8.5
  Top Layer w0.254: LED1.1 65.86,11.35 v1(67.06,12.56)
$1N8496: length 8
  Top Layer w0.254: LED2.1 58.26,12.56 v1(64.52,12.56)
$1N8497: length 4
  Top Layer w0.508: LED2.2 LED1.2 59.09,8.53 v1(58.57,8.01)
$1N8502: length 2.7
  Bottom Layer w0.508: U1.3 65.87,12.48 R7.2
$1N8503: length 14.8
  Top Layer w0.508: L1.2 60.1,18.55 61.37,19.82 67.37,19.82 68.33,18.86 v1(68.33,18.14)
  Bottom Layer w0.508: D3.2 71.4,18.14 v1(68.33,18.14)

## Copper pours and planes (outline as drawn; the poured copper is in the pictures)
3V3 on Inner2: 0.26,54.74 85.74,54.74 85.74,0.26 0.26,0.26
12V on Top Layer: -5.3,62.49 90.84,62.49 90.84,-4.56 -5.3,-4.56
+5V on Inner1: 0.26,54.74 85.74,54.74 85.74,0.26 0.26,0.26
GND on Bottom Layer: -6.7,63.76 95.28,63.76 95.28,-8.12 -6.7,-8.12

Small or netless copper shapes (teardrops, artwork), in the pictures only: 78 on Top Layer, 56 on Bottom Layer, 18 on Inner1, 16 on Inner2

## Text on the board
Bottom Silkscreen Layer: V12 | GND
Top Silkscreen Layer: RST | 12V+ | GND | GND / 3V3 / TX / RX | 5V | 12V | FOC_R | FOC_L
